# EAGLE design Board Playground4Robotics_V3 (EAGLE 9.5.2)
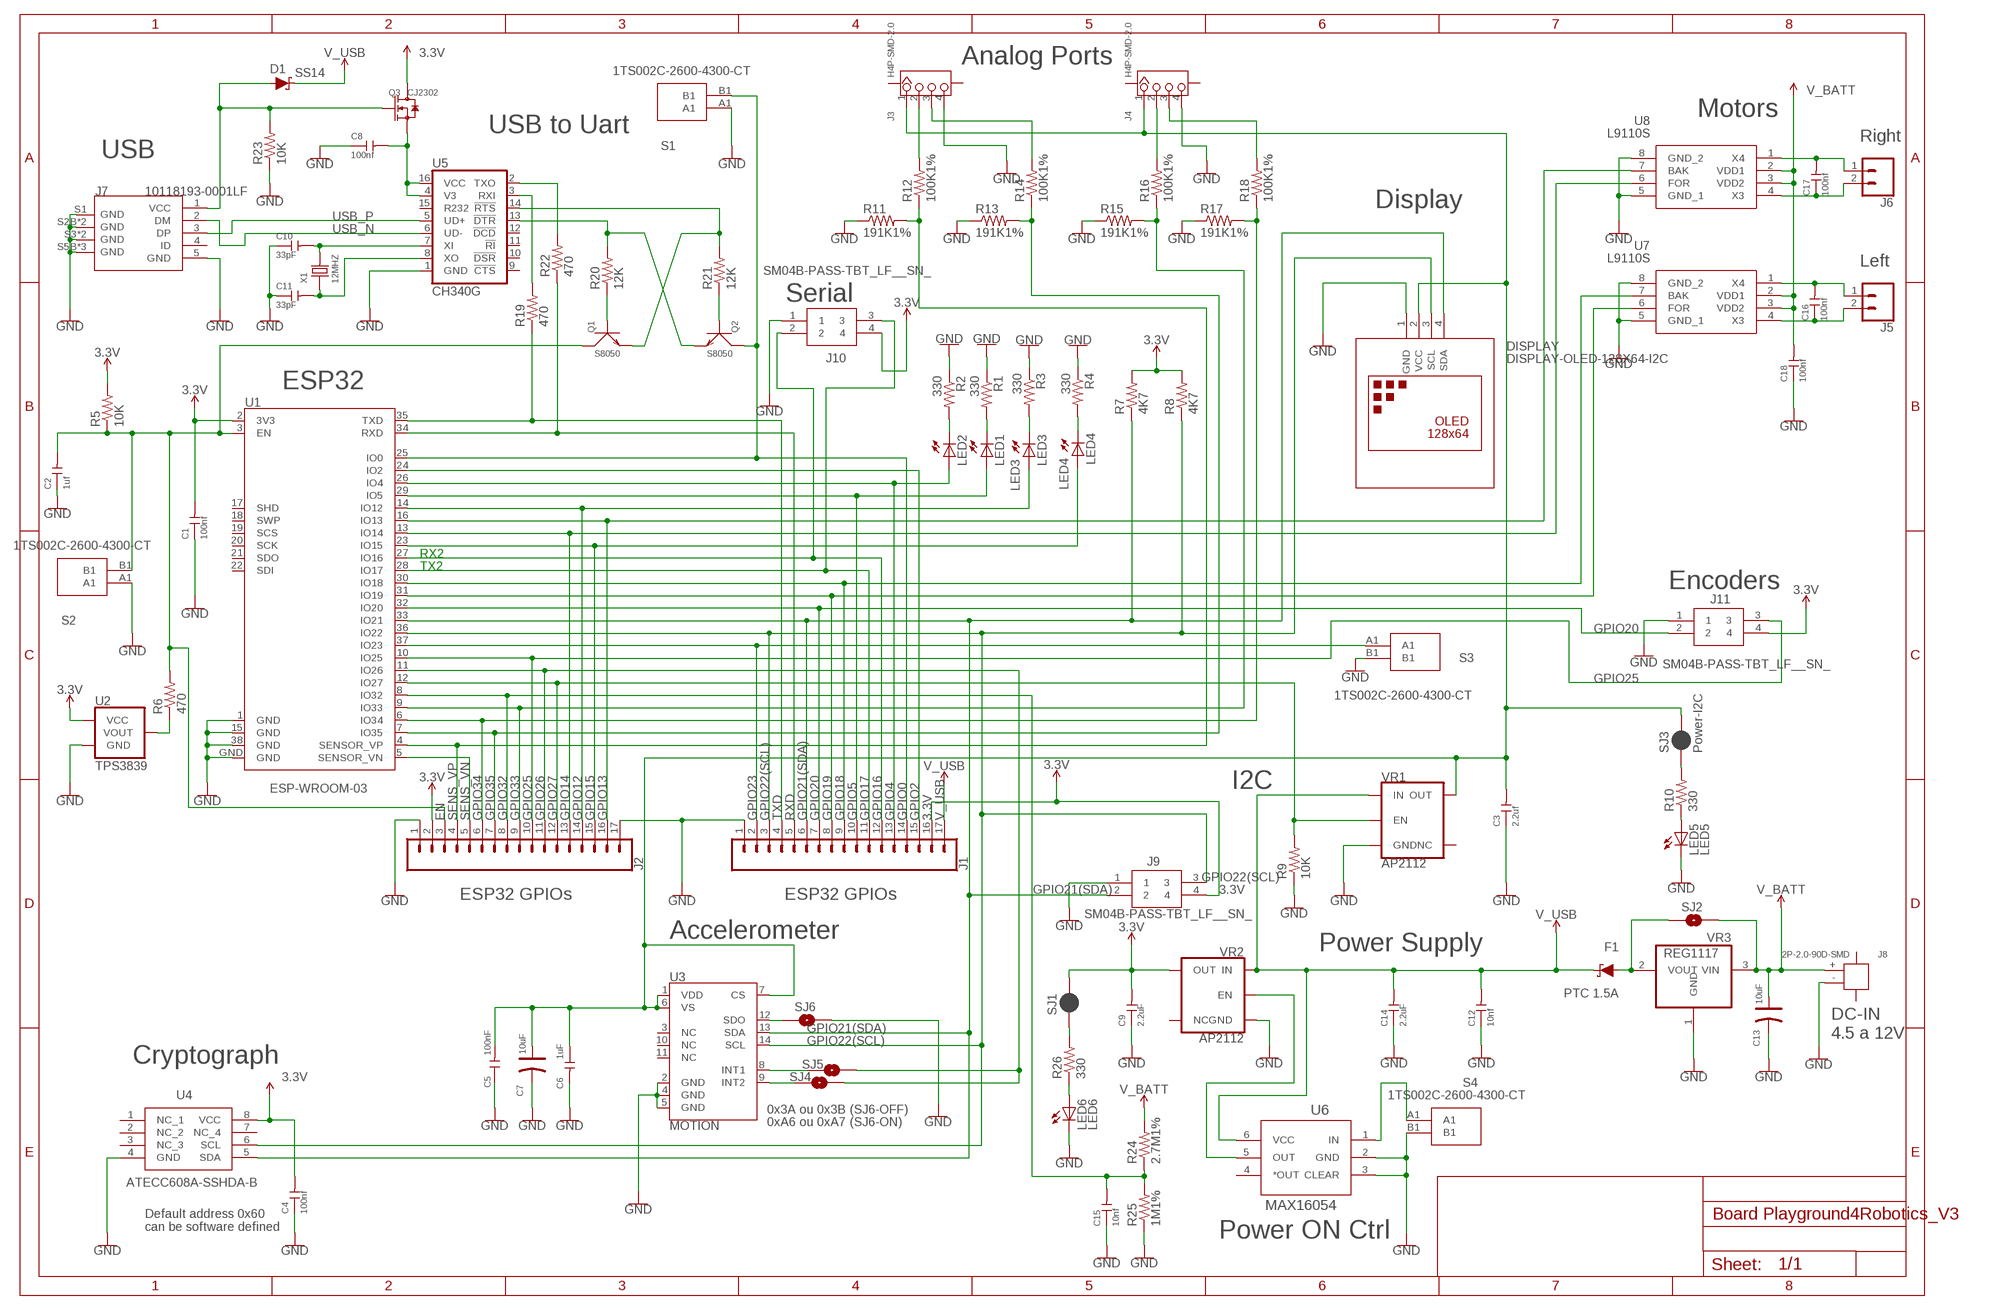
[diagram p0: schematic, sheet 1]

## Parts
C1  100nf  CERAMIC-100NF-50V-10%-X7R(0603)  [C0603]
C2  1uf  CERAMIC-100NF-50V-10%-X7R(0603)  [C0603]
C3  2.2uf  CERAMIC-2.2UF-10V-10%-X7R(0603)  [C0603]
C4  100nf  CERAMIC-100NF-50V-10%-X7R(0603)  [C0603]
C5  100nF  C-0603  [C0603]
C6  1uF  C-0805  [C0805]
C7  10uF  CAP-AVX-A  [AVX-A]
C8  100nf  CERAMIC-100NF-50V-10%-X7R(0603)  [C0603]
C9  2.2uF  CERAMIC-2.2UF-10V-10%-X7R(0603)  [C0603]
C10  33pF  CERAMIC-10PF-50V-5%-NPO(0603)  [C0603]
C11  33pF  CERAMIC-10PF-50V-5%-NPO(0603)  [C0603]
C12  10nf  CERAMIC-100NF-50V-10%-X7R(0603)  [C0603]
C13  10uF  CAP-AVX-A  [AVX-A]
C14  2.2uF  CERAMIC-2.2UF-10V-10%-X7R(0603)  [C0603]
C15  10nf  CERAMIC-100NF-50V-10%-X7R(0603)  [C0603]
C16  100nf  CERAMIC-100NF-50V-10%-X7R(0603)  [C0603]
C17  100nf  CERAMIC-100NF-50V-10%-X7R(0603)  [C0603]
C18  100nf  CERAMIC-100NF-50V-10%-X7R(0603)  [C0603]
D1  SS14  DIODE-SCHOTTKY-SS14  [SMA-DIODE]
DISPLAY  DISPLAY-OLED-128X64-I2C  [DISPLAY-OLED-128X64-I2C]
F1  PTC 1.5A  DIODE-SCHOTTKY-SS14  [SMA-DIODE]
J1  CONN_17  [1X17]
J2  CONN_17  [1X17]
J3  H4P-SMD-2.0  GROVE-CONNECTOR-SMD(4+2P-2.0)  [HW4-SMD-2.0]
J4  H4P-SMD-2.0  GROVE-CONNECTOR-SMD(4+2P-2.0)  [HW4-SMD-2.0]
J5  CONN_02POLAR  [MOLEX-1X2]
J6  CONN_02POLAR  [MOLEX-1X2]
J7  10118193-0001LF  MICRO-USB-SMD-B-(10118193-0001LF)  [MICRO-USB5+6P-SMD-0.65-B]
J8  2P-2.0-90D-SMD  CONN-HEADER-SMD-PH-SIDE-(2P-2.0MM)  [HW2-SMD-2.0-90D]
J9  SM04B-PASS-TBT_LF__SN_  [SM04B-PASS-TBT]
J10  SM04B-PASS-TBT_LF__SN_  [SM04B-PASS-TBT]
J11  SM04B-PASS-TBT_LF__SN_  [SM04B-PASS-TBT]
LED1  LED1  LED0603  [LED-0603]
LED2  LED2  LED0603  [LED-0603]
LED3  LED3  LED0603  [LED-0603]
LED4  LED4  LED0603  [LED-0603]
LED5  LED5  LED0603  [LED-0603]
LED6  LED6  LED0603  [LED-0603]
Q1  S8050  SMD-TRANSISTORS-NPN-25V-500MW-S8050(SOT-23)  [SOT-23]
Q2  S8050  SMD-TRANSISTORS-NPN-25V-500MW-S8050(SOT-23)  [SOT-23]
Q3  CJ2302  SMD-MOSFET-N-CH-20V-2.1A-CJ2302(SOT-23)  [SOT-23]
R1  330  RESISTOR0805-RES  [0805]
R2  330  RESISTOR0805-RES  [0805]
R3  330  RESISTOR0805-RES  [0805]
R4  330  RESISTOR0805-RES  [0805]
R5  10K  RESISTOR0805-RES  [0805]
R6  470  RESISTOR0805-RES  [0805]
R7  4K7  RESISTOR0805-RES  [0805]
R8  4K7  RESISTOR0805-RES  [0805]
R9  10K  RESISTOR0805-RES  [0805]
R10  330  RESISTOR0805-RES  [0805]
R11  191K1%  RESISTOR0805-RES  [0805]
R12  100K1%  RESISTOR0805-RES  [0805]
R13  191K1%  RESISTOR0805-RES  [0805]
R14  100K1%  RESISTOR0805-RES  [0805]
R15  191K1%  RESISTOR0805-RES  [0805]
R16  100K1%  RESISTOR0805-RES  [0805]
R17  191K1%  RESISTOR0805-RES  [0805]
R18  100K1%  RESISTOR0805-RES  [0805]
R19  470  RESISTOR0805-RES  [0805]
R20  12K  RESISTOR0805-RES  [0805]
R21  12K  RESISTOR0805-RES  [0805]
R22  470  RESISTOR0805-RES  [0805]
R23  10K  RESISTOR0805-RES  [0805]
R24  2.7M1%  RESISTOR0805-RES  [0805]
R25  1M1%  RESISTOR0805-RES  [0805]
R26  330  RESISTOR0805-RES  [0805]
S1  1TS002C-2600-4300-CT  [1TS002C26004300CT]
S2  1TS002C-2600-4300-CT  [1TS002C26004300CT]
S3  1TS002C-2600-4300-CT  [1TS002C26004300CT]
S4  1TS002C-2600-4300-CT  [1TS002C26004300CT]
SJ1  Power-Led  JUMPER-SMT_2_NC_PASTE_SILK  [SMT-JUMPER_2_NC_PASTE_SILK]
SJ2  ADXL_ADDRESS  SOLDERJUMPERNO  [SJ_2S-NO]
SJ3  Power-I2C  JUMPER-SMT_2_NC_PASTE_SILK  [SMT-JUMPER_2_NC_PASTE_SILK]
SJ4  INT1  SOLDERJUMPERNO  [SJ_2S-NO]
SJ5  INT1  SOLDERJUMPERNO  [SJ_2S-NO]
SJ6  ADXL_ADDRESS  SOLDERJUMPERNO  [SJ_2S-NO]
U1  ESP-WROOM-03  [ESP-WROOM-03]
U2  TPS3839  V_SUPERVISOR  [SOT23-3]
U3  MOTION  ADXL345  [LGA-14]
U4  ATECC608A-SSHDA-B  [SOIC127P600X175-8N]
U5  CH340G  CH340GSMD  [SO016]
U6  MAX16054  [SOT23-6]
U7  L9110S  [SOIC127P600X175-8N]
U8  L9110S  [SOIC127P600X175-8N]
VR1  AP2112  V_REG_AP2112K-3.3V  [SOT23-5]
VR2  AP2112  V_REG_AP2112K-3.3V  [SOT23-5]
VR3  REG1117  [SOT223]
X1  12MHZ  SMD-CRYSTAL-12MHZ-20PF-20PPM-40R(2P-5.0X3.2MM)  [X2-SMD-5.0X3.2X1.3MM]

## Nets
3.3V [power]: C1.2 C4.2 C9.2 J1.16 J2.2 J9.4 J10.4 J11.4 Q3.3(D) R5.2 R7.2 R8.2 SJ1.2 U1.2(3V3) U2.3(VCC) U4.8(VCC) VR2.5(OUT)
EN: C2.2 J2.3 Q1.3(C) R5.1 R6.2 S2.B1 U1.3(EN)
GND [power]: C1.1 C2.1 C3.1 C4.1 C5.1 C6.2 C7.- C8.1 C9.1 C10.1 C11.1 C12.1 C13.- C14.1 C15.1 C18.1 DISPLAY.1(GND) J1.1 J2.1 J2.17 J3.4 J4.4 J7.5(GND) J7.S1(GND) J7.S2B(GND) J7.S2T(GND) J7.S3(GND) J7.S4(GND) J7.S5B(GND) J7.S5T(GND) J7.S6(GND) J8.- J9.1 J10.1 J11.1 LED5.C LED6.C R1.1 R2.1 R3.1 R4.1 R9.1 R11.1 R13.1 R15.1 R17.1 R23.1 R25.1 S1.A1 S2.A1 S3.B1 S4.B1 SJ6.2 U1.1(GND) U1.15(GND) U1.38(GND) U1.GND U2.1(GND) U3.2(GND) U3.4(GND) U3.5(GND) U4.4(GND) U5.1(GND) U6.2(GND) U6.3(CLEAR) U7.5(GND_1) U7.8(GND_2) U8.5(GND_1) U8.8(GND_2) VR1.2(GND) VR2.2(GND) VR3.1(GND)
GPIO0: J1.14 Q2.3(C) S1.B1 U1.25(IO0)
GPIO2: J1.15 U1.24(IO2)
GPIO4: J1.13 LED2.A U1.26(IO4)
GPIO5: J1.10 LED1.A U1.29(IO5)
GPIO12: J2.14 LED3.A U1.14(IO12)
GPIO13: J2.16 U1.16(IO13) U8.7(BAK)
GPIO14: J2.13 U1.13(IO14) U8.6(FOR)
GPIO15: J2.15 LED4.A U1.23(IO15)
GPIO16: J1.12 J10.2 U1.27(IO16)
GPIO17: J1.11 J10.3 U1.28(IO17)
GPIO18: J1.9 U1.30(IO18) U7.7(BAK)
GPIO19: J1.8 U1.31(IO19) U7.6(FOR)
GPIO20: J1.7 J11.2 U1.32(IO20)
GPIO21(SDA): DISPLAY.4(SDA) J1.6 J9.2 R7.1 U1.33(IO21) U3.13(SDA) U4.5(SDA)
GPIO22(SCL): DISPLAY.3(SCL) J1.3 J9.3 R8.1 U1.36(IO22) U3.14(SCL) U4.6(SCL)
GPIO23: J1.2 S3.A1 U1.37(IO23)
GPIO25: J2.10 J11.3 U1.10(IO25)
GPIO26: J2.11 SJ4.2 SJ5.2 U1.11(IO26)
GPIO27: J2.12 R9.2 U1.12(IO27) VR1.3(EN)
GPIO32: C15.2 J2.8 R24.1 R25.2 U1.8(IO32)
GPIO33: J2.9 R15.2 R16.1 U1.9(IO33)
GPIO34: J2.6 R17.2 R18.1 U1.6(IO34)
GPIO35: J2.7 R13.2 R14.1 U1.7(IO35)
N$1: D1.A J7.1(VCC) Q3.1(G) R23.2
N$3 [VBAT]: C17.2 J6.1 U8.1(X4)
N$4: R6.1 U2.2(VOUT)
N$7: J3.2 R12.2
N$8: SJ5.1 U3.8(INT1)
N$9: SJ4.1 U3.9(INT2)
N$10 [power]: C8.2 Q3.2(S) U5.4(V3) U5.16(VCC)
N$14: S4.A1 U6.1(IN)
N$15: C10.2 U5.7(XI) X1.2
N$18 [power]: U6.5(OUT) VR2.3(EN)
N$19: Q1.1(B) R20.1
N$20: C11.2 U5.8(XO) X1.1
N$21: SJ6.1 U3.12(SDO)
N$22 [VBAT]: C17.1 J6.2 U8.4(X3)
N$23 [VBAT]: C16.2 J5.1 U7.1(X4)
N$24 [VBAT]: C16.1 J5.2 U7.4(X3)
N$25: J3.3 R14.2
N$30: Q2.1(B) R21.1
N$31 [power]: F1.A SJ2.1 VR3.2(VOUT)
N$32: LED2.C R2.2
N$33: LED1.C R1.2
N$34: Q1.2(E) R21.2 U5.14(!RTS)
N$35: LED4.C R4.2
N$36: LED3.C R3.2
N$38: Q2.2(E) R20.2 U5.13(!DTR)
N$41: J4.2 R16.2
N$42: J4.3 R18.2
N$43 [power]: C3.2 C5.2 C6.1 C7.+ DISPLAY.2(VCC) J3.1 J4.1 SJ3.2 U3.1(VDD) U3.6(VS) U3.7(CS) VR1.5(OUT)
N$44: R19.2 U5.3(RXI)
N$45: R22.2 U5.2(TXO)
N$51: LED6.A R26.1
N$52: R26.2 SJ1.1
N$55: LED5.A R10.1
N$58: R10.2 SJ3.1
RXD: J1.5 R22.1 U1.34(RXD)
SENS_VN: J2.5 U1.5(SENSOR_VN)
SENS_VP: J2.4 R11.2 R12.1 U1.4(SENSOR_VP)
TXD: J1.4 R19.1 U1.35(TXD)
USB_N [diff pairs]: J7.2(DM) U5.6(UD-)
USB_P [diff pairs]: J7.3(DP) U5.5(UD+)
V_BATT [VBAT]: C13.+ C18.2 J8.+ R24.2 SJ2.2 U7.2(VDD1) U7.3(VDD2) U8.2(VDD1) U8.3(VDD2) VR3.3(VIN)
V_USB [power]: C12.2 C14.2 D1.C F1.C J1.17 U6.6(VCC) VR1.1(IN) VR2.1(IN)
Unconnected: J3.SS1 J3.SS2 J4.SS1 J4.SS2 J7.4(ID) J8.3 J8.4 U1.17(SHD) U1.18(SWP) U1.19(SCS) U1.20(SCK) U1.21(SDO) U1.22(SDI) U3.3(NC) U3.10(NC) U3.11(NC) U4.1(NC_1) U4.2(NC_2) U4.3(NC_3) U4.7(NC_4) U5.9(!CTS) U5.10(!DSR) U5.11(!RI) U5.12(!DCD) U5.15(R232) U6.4(*OUT) VR1.4(NC) VR2.4(NC)

## Notes on the sheet
- Analog Ports
- Motors
- USB to Uart
- Right
- USB
- Display
- Left
- Serial
- ESP32
- RX2
- TX2
- Encoders
- I2C
- ESP32 GPIOs | ESP32 GPIOs
- Accelerometer
- Power Supply
- DC-IN
  4.5 a 12V
- Cryptograph
- 0x3A ou 0x3B (SJ6-OFF)
- 0xA6 ou 0xA7 (SJ6-ON)
- Default address 0x60
  can be software defined
- Power ON Ctrl

## Library data of the parts
C1 C4 C8 C16-C18 = OPL_Capacitor:CERAMIC-100NF-50V-10%-X7R(0603): 302010138; MPN: CC0603KRX7R9BB104
C2 C12 C15 = OPL_Capacitor:CERAMIC-100NF-50V-10%-X7R(0603): 302010138; MPN: CC0603KRX7R9BB104; VALUE: 100nf
C3 = OPL_Capacitor:CERAMIC-2.2UF-10V-10%-X7R(0603): 302010054; MPN: CC0603KRX7R6BB225
C5 C6 = Discrete:C*: Ceramic Capacitors
C7 C13 = Discrete:CAP*: Electrolytic Capacitors,Tantalum Capacitors and Super Capacitors
C9 C14 = OPL_Capacitor:CERAMIC-2.2UF-10V-10%-X7R(0603): 302010054; MPN: CC0603KRX7R6BB225; VALUE: 2.2uf
C10 C11 = OPL_Capacitor:CERAMIC-10PF-50V-5%-NPO(0603): 302010097; MPN: CC0603JRNPO9BN100; VALUE: 10pf
D1 F1 = SparkFun-DiscreteSemi:DIODE-SCHOTTKY: Schottky diode A Schottky diode is a semiconductor diode which has a low forward voltage drop and a very fast switching action.; PROD_ID: DIO-08053; VALUE: 1A/40V/500mV
DISPLAY = diy-modules:DISPLAY-OLED-128X64-I2C: 128x64 Dot Matrix OLED Module based on SSD1306 chip Variant with I2C interface More details available here: http://www.instructables.com/id/Monochrome-096-i2c-OLED-display-with-arduino-SSD13/ SSD1306 datasheet: https://cdn-shop.adafruit.com/datasheets/SSD1306.pdf Click here to find device on ebay.com <http://www.ebay.com/sch/oled+display+128x64+iic> Note: There are two variants: I2C and SPI. Search for the proper version.
J1 J2 = SparkFun-Connectors:CONN_17: Multi connection point. Often used as Generic Header-pin footprint for 0.1 inch spaced/style header connections On any of the 0.1 inch spaced packages, you can populate with these: Break Away Headers - Straight <https://www.sparkfun.com/products/116> (PRT-00116) Break Away Male Headers - Right Angle <https://www.sparkfun.com/products/553> (PRT-00553) Female Headers <https://www.sparkfun.com/products/115> (PRT-00115) Break Away Headers - Machine Pin <https://www.sparkfun.com/products/117> (PRT-00117) Break Away Female Headers - Swiss Machine Pin <https://www.sparkfun.com/products/743> (PRT-00743) For SCREWTERMINALS and SPRING TERMINALS visit here: Screw Terimnals on SparkFun.com <https://www.sparkfun.com/search/results?term=Screw+Terminals> (5mm/3.5mm/2.54mm spacing) This device is also useful as a general connection point to wire up your design to another part of your project. Our various solder wires solder well into these plated through hole pads. Hook-Up Wire - Assortment (Stranded, 22 AWG) <https://www.sparkfun.com/products/11375> (PRT-11375) Hook-Up Wire - Assortment (Solid Core, 22 AWG) <https://www.sparkfun.com/products/11367> (PRT-11367) View the entire wire category on our website here <https://www.sparkfun.com/categories/141> Special notes: Molex polarized connector foot print use with SKU : PRT-08231 with associated crimp pins and housings. 1MM SMD Version SKU: PRT-10208 NOTES ON THE VARIANTS LOCK and LOCK_LONGPADS... This footprint was designed to help hold the alignment of a through-hole component (i.e. 6-pin header) while soldering it into place. You may notice that each hole has been shifted either up or down by 0.005 of an inch from it's more standard position (which is a perfectly straight line). This slight alteration caused the pins (the squares in the middle) to touch the edges of the holes. Because they are alternating, it causes a "brace" to hold the component in place. 0.005 has proven to be the perfect amount of "off-center" position when using our standard breakaway headers. Although looks a little odd when you look at the bare footprint, once you have a header in there, the alteration is very hard to notice. Also,if you push a header all the way into place, it is covered up entirely on the bottom side.
J3 = OPL_Connector:GROVE-CONNECTOR-SMD(4+2P-2.0): 320110030; SPICEPREFIX: X
J4 = OPL_Connector:GROVE-CONNECTOR-SMD(4+2P-2.0): 320110030
J5 J6 = SparkFun-Connectors:CONN_02: Multi connection point. Often used as Generic Header-pin footprint for 0.1 inch spaced/style header connections On any of the 0.1 inch spaced packages, you can populate with these: Break Away Headers - Straight <https://www.sparkfun.com/products/116> (PRT-00116) Break Away Male Headers - Right Angle <https://www.sparkfun.com/products/553> (PRT-00553) Female Headers <https://www.sparkfun.com/products/115> (PRT-00115) Break Away Headers - Machine Pin <https://www.sparkfun.com/products/117> (PRT-00117) Break Away Female Headers - Swiss Machine Pin <https://www.sparkfun.com/products/743> (PRT-00743) For SCREWTERMINALS and SPRING TERMINALS visit here: Screw Terimnals on SparkFun.com <https://www.sparkfun.com/search/results?term=Screw+Terminals> (5mm/3.5mm/2.54mm spacing) This device is also useful as a general connection point to wire up your design to another part of your project. Our various solder wires solder well into these plated through hole pads. Hook-Up Wire - Assortment (Stranded, 22 AWG) <https://www.sparkfun.com/products/11375> (PRT-11375) Hook-Up Wire - Assortment (Solid Core, 22 AWG) <https://www.sparkfun.com/products/11367> (PRT-11367) View the entire wire category on our website here <https://www.sparkfun.com/categories/141> Special notes: Molex polarized connector foot print use with: PRT-08233 with associated crimp pins and housings. 2.54_SCREWTERM for use with PRT-10571. 3.5mm Screw Terminal footprints for PRT-08084 5mm Screw Terminal footprints for use with PRT-08432; SF_ID: PRT-09918
J7 = OPL_Connector:MICRO-USB-SMD-B-(10118193-0001LF): Seeed SKU 320010003 - SMD Micro USB-B MPN: 10118193-0001LF Important Notes: This part requires milling slots. Please make sure layer 46 Milling is included in the profile or outline layer when exporting Gerber files. Alternatively, you can use the built-in Seeed Fusion CAM file. Find it under Third-Party CAM files. This part has an overhanging portion. The edge of the PCB should be aligned with the line marked PCB Edge to be mounted correctly. Seeed Fusion PCBA OPL <https://www.seeedstudio.com/opl.html> Order PCB/PCBA Now <https://www.seeedstudio.com/fusion_pcb.html> www.seeedstudio.com; MPN: 10118193-0001LF
J8 = OPL_Connector:CONN-HEADER-SMD-PH-SIDE-(2P-2.0MM): 320110026
J9-J11 = SM04B-PASS-TBT_LF__SN_:SM04B-PASS-TBT_LF__SN_: JST (JAPAN SOLDERLESS TERMINALS) - SM04B-PASS-TBT(LF)(SN) - CONNECTOR, HEADER, 4POS, 1ROW, 2MM Source: Datasheet <http://www.jst-mfg.com/product/pdf/eng/ePA-F.pdf>; DESCRIPTION: JST (JAPAN SOLDERLESS TERMINALS) - SM04B-PASS-TBT(LF)(SN) - CONNECTOR, HEADER, 4POS, 1ROW, 2MM; HEIGHT: mm; MANUFACTURER_NAME: JST (JAPAN SOLDERLESS TERMINALS); MANUFACTURER_PART_NUMBER: SM04B-PASS-TBT(LF)(SN)
LED1-LED6 = FTDI Basic-v22-3.3V:LED: LEDs Standard schematic elements and footprints for 5mm, 3mm, 1206, and 0603 sized LEDs. 5mm - Spark Fun Electronics SKU : COM-00529 (and others)
Q1 Q2 = OPL_Discrete_Semiconductor:SMD-TRANSISTORS-NPN-25V-500MW-S8050(SOT-23): 305010017; MPN: S8050
Q3 = OPL_Discrete_Semiconductor:SMD-MOSFET-N-CH-20V-2.1A-CJ2302(SOT-23): 305030015; MPN: CJ2302
R1-R11 R13-R15 R17-R26 = FTDI Basic-v22-3.3V:RESISTOR: Resistor Basic schematic elements and footprints for 0603, 1206, and PTH resistors.
R12 R16 = FTDI Basic-v22-3.3V:RESISTOR: Resistor Basic schematic elements and footprints for 0603, 1206, and PTH resistors.; SPICEPREFIX: R
S1-S4 = 1TS002C-2600-4300-CT:1TS002C-2600-4300-CT: Tactile Switches SPST 6.00mm x 3.50mm 0.80mm 50mA @ 12VDC SMD,6x3.5x4.3mm RoHS Source: Datasheet <https://datasheet.lcsc.com/szlcsc/HYP-1TS002C-2600-4300_C319342.pdf>; DESCRIPTION: Tactile Switches SPST 6.00mm x 3.50mm 0.80mm 50mA @ 12VDC SMD,6x3.5x4.3mm RoHS; HEIGHT: 4.5mm; MANUFACTURER_NAME: HYP (Hongyuan Precision); MANUFACTURER_PART_NUMBER: 1TS002C-2600-4300-CT
SJ1 SJ3 = SparkFun-Jumpers:JUMPER-SMT_2_NC_PASTE: Normally closed solder jumper This jumper has an aperture in the stencil to allow solder paste to bridge the split in the wire so it's normally closed (NC). Wick off the solder to open the connection. Reapply solder to reclose the connection.
SJ2 SJ4-SJ6 = JL-temp:SOLDERJUMPER: Solder Jumper Standard SMD solder jumper. Used to automate production. Two varients : Normally Open and Normally Closed are the same, but have different paste layers. NC will have a large amount of paste and should jumper during reflow.
U1 = esp32:ESP-WROOM-03
U2 = SparkFun-IC-Power:V_SUPERVISOR: BD48xxx - Voltage Detector IC ROHM’s BD48xxx and BD49xxx series are highly accurate, low-current Voltage Detector IC series. The family includes BD48xxx devices with N-channel open drain output and BD49xxx devices with CMOS output. The devices are available for specific detection voltages ranging from 2.3V to 6.0V in increments of 0.1V.; PROD_ID: IC-14809
U3 = SparkFun-Sensors:ADXL345: Analog Devices ADXL345 3-Axis SPI/I2C 2/4/8/16g Accelerometer The ADXL345 is a small, thin, low power, 3-axis accelerometer with high resolution (13-bit) measurement at up to ±16g. Digital output data is formatted as 16-bit twos complement and is accessible through either a SPI (3- or 4-wire) or I2C digital interface. Datasheet <https://www.sparkfun.com/datasheets/Sensors/Accelerometer/ADXL345.pdf> SparkFun Products SparkFun Triple Axis Accelerometer Breakout - ADXL345 <https://www.sparkfun.com/products/9836> (SEN-09836) Triple Axis Accelerometer - ADXL345 <https://www.sparkfun.com/products/9045> (SEN-09045) SparkFun 6 Degrees of Freedom IMU Digital Combo Board - ITG3200/ADXL345 <https://www.sparkfun.com/products/10121> (SEN-10121); PROD_ID: IC-09097; SF_ID: SEN-09045
U4 = ATECC608A-SSHDA-B:ATECC608A-SSHDA-B: Cryptoathentication ECC608A SOIC Source: Datasheet <http://ww1.microchip.com/downloads/en/DeviceDoc/40001977A.pdf>; ARROW_PART_NUMBER: ATECC608A-SSHDA-B; ARROW_PRICE-STOCK: https://www.arrow.com/en/products/atecc608a-sshda-b/microchip-technology; DESCRIPTION: Cryptoathentication ECC608A SOIC; HEIGHT: 1.75mm; MANUFACTURER_NAME: Microchip; MANUFACTURER_PART_NUMBER: ATECC608A-SSHDA-B; MOUSER_PART_NUMBER: 556-ATECC608ASSHDAB; MOUSER_PRICE-STOCK: https://www.mouser.co.uk/ProductDetail/Microchip-Technology-Atmel/ATECC608A-SSHDA-B?qs=wd5RIQLrsJj8ay8%2FHpTWlw%3D%3D
U5 = SparkFun-IC-Comms:CH340G: A simple USB 2.0 to Serial IC.; PROD_ID: IC-13498
U6 = max16054:MAX16054: MAXIM Integrated power controller chip; MF: Maxim Integrated; MOUSER: 700-MAX16054AZTT; MPN: MAX16054AZT+T
U7 U8 = L9110S:L9110S: Motor Drivers SOP-8_150mil RoHS Source: Datasheet <https://datasheet.lcsc.com/szlcsc/Wuxi-Zhongwei-Aisin-Elec-L9110S_C85174.pdf>; DESCRIPTION: Motor Drivers SOP-8_150mil RoHS; HEIGHT: 1.75mm; MANUFACTURER_NAME: Wuxi I-core Elec; MANUFACTURER_PART_NUMBER: L9110S
VR1 VR2 = SparkFun-IC-Power:V_REG_AP2112: AP2112 - 600mA CMOS LDO Regulator w/ Enable The AP2112 is CMOS process low dropout linear regulator with enable function, the regulator delivers a guaranteed 600mA (min.) continuous load current. Features Output Voltage Accuracy: ±1.5% Output Current: 600mA (Min.) Foldback Short Current Protection: 50mA Enable Function to Turn ON/OFF VOUT Low Dropout Voltage (3.3V): 250mV (Typ.) @IOUT=600mA Excellent Load Regulation: 0.2%/A (Typ.) Excellent Line Regulation: 0.02%/V (Typ.) Low Quiescent Current: 55μA (Typ.) Low Standby Current: 0.01μA (Typ.) Low Output Noise: 50μVRMS PSRR: 100Hz -65dB, 1kHz -65dB OTSD Protection Stable with 1.0μF Flexible Cap: Ceramic, Tantalum and Aluminum Electrolytic Operation Temperature Range: -40°C to 85°C ESD: MM 400V, HBM 4000V; PROD_ID: VREG-12457; VALUE: 3.3V
VR3 = burr-brown:REG1117: 800mA and 1A Low Dropout (LDO) Positive Regulator 1.8V, 2.5V, 2.85V, 3.3V, 5V, and Adj; MPN: REG1117; OC_FARNELL: 1097566; OC_NEWARK: 14P6981
X1 = OPL_Crystal Oscillator:SMD-CRYSTAL-12MHZ-20PF-20PPM-40R(2P-5.0X3.2MM): 306010047; MPN: 5032/2P

## Net classes
0 default: width 0.254 mm, clearance 0.127 mm
1 power: width 0.508 mm, clearance 0.127 mm
2 sensor: width 0.381 mm, clearance 0.127 mm
3 diff pairs: width 0.254 mm
4 VBAT: width 0.635 mm

## Board
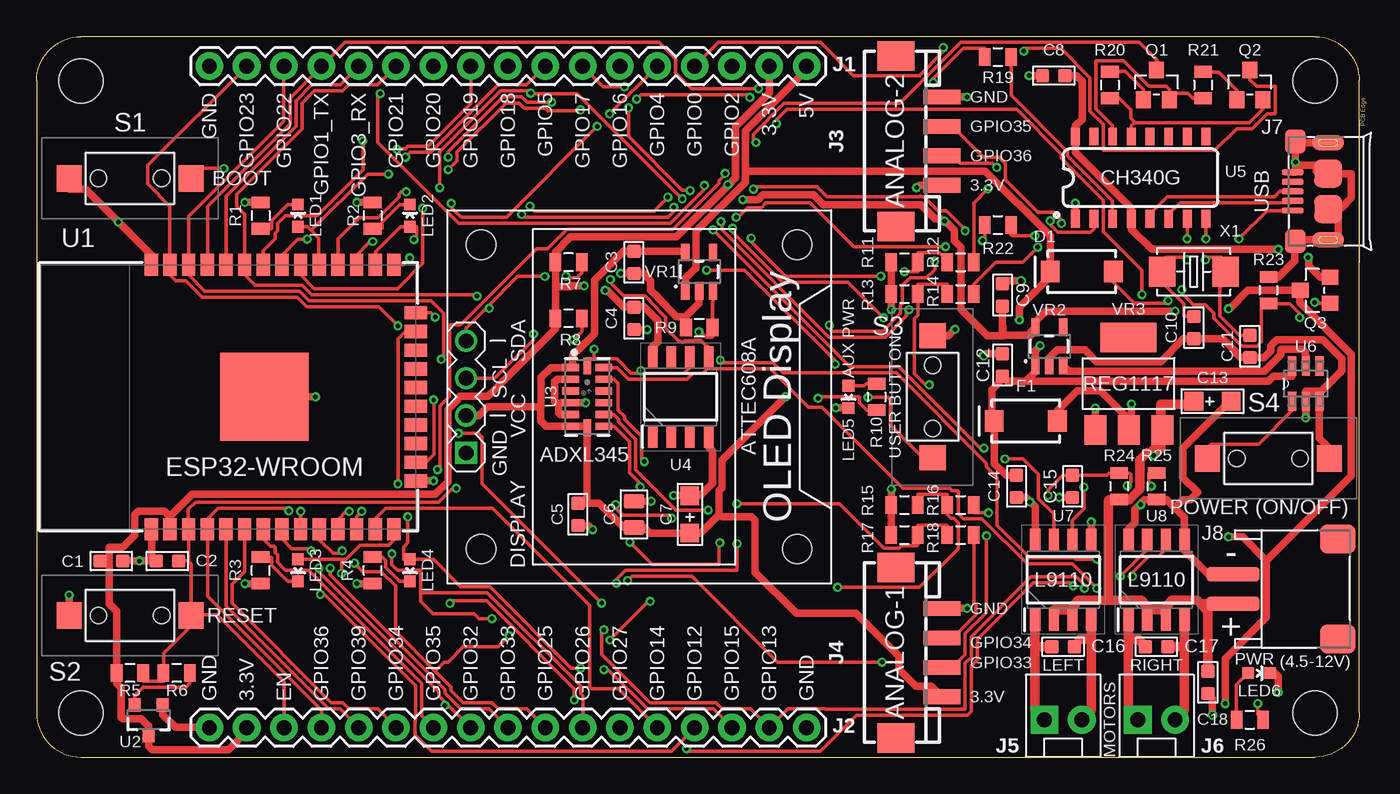
[diagram p1: board, top side]
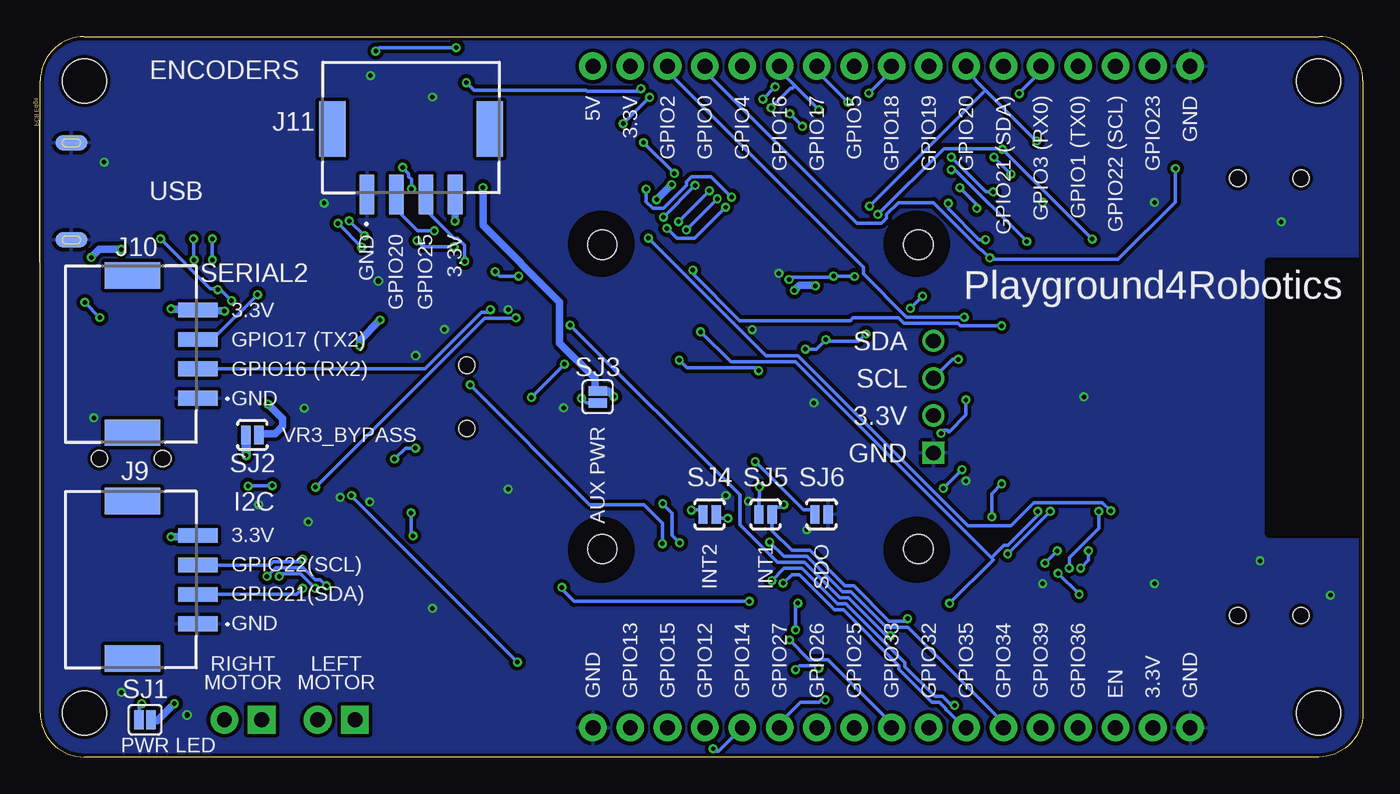
[diagram p2: board, bottom side, seen from below]

Size 90.03 x 49 mm. Coordinates in mm from the lower left corner, seen from the top.
Outline: 3,0 87,0 arc90 90,3 90,46 arc90 87,49 3,49 arc90 0,46 0,3 arc90 3,0
Copper layers (1*16): Top 0.035mm / dielectric 1.5mm / Bottom 0.035mm
Design rules "SeeedStudio_2layer_DRU_no_angle_20140221": minimum track width 6mil, minimum drill 12mil, track to track 6mil, track to pad 6mil, pad to pad 6mil, via to via 6mil, smd to smd 0mil, copper to edge 10mil, drill to drill 10mil, minimum pad ring 10mil, minimum via ring 6mil, stop-mask expansion 2mil, vias tented up to drill 100mil, thermal gap 10mil
Holes 3 mm at 3,3 3,46 87,46 87,3
tRestrict: area 0,15.2 to 6.3,33.7; area 1.5,1.5 to 4.5,4.5; area 1.5,44.5 to 4.5,47.5; area 85.5,44.5 to 88.5,47.5; area 85.5,1.5 to 88.5,4.5
bRestrict: area 0,15.2 to 6.3,33.7; area 29.4,33.9 to 31.4,35.9; area 50.8,33.9 to 52.8,35.9; area 29.4,13.1 to 31.4,15.1; area 50.8,13.1 to 52.8,15.1

### Footprints (pad centres in the part's own frame; a part is rotated, then mirrored left to right if it is on the bottom)
C0603 = smd 0.889 x 0.889: 1 0,0.762; 2 0,-0.762
C0603' = smd 0.889 x 0.889: 1 -0.762,0; 2 0.762,0
C0805 = smd 1.016 x 1.397: 1 -0.889,0; 2 0.889,0
AVX-A = smd 1.27 x 1.27: + -1.27,0; - 1.27,0
SMA-DIODE = smd 1.27 x 1.47: A -2.15,0; C 2.15,0
DISPLAY-OLED-128X64-I2C = drill 1 square: 1 -3.81,11.78 | drill 1: 2 -1.27,11.78; 3 1.27,11.78; 4 3.81,11.78 | hole 2: -10.35,10.75; 10.35,10.75; 10.35,-10.75; -10.35,-10.75
1X17 = drill 1.016 pad 1.88: 1 0,0; 2 2.54,0; 3 5.08,0; 4 7.62,0; 5 10.16,0; 6 12.7,0; 7 15.24,0; 8 17.78,0; 9 20.32,0; 10 22.86,0; 11 25.4,0; 12 27.94,0; 13 30.48,0; 14 33.02,0; 15 35.56,0; 16 38.1,0; 17 40.64,0
HW4-SMD-2.0 = smd 1 x 2.5: 1 -3,0; 2 -1,0; 3 1,0; 4 3,0 | smd 2 x 2.5: SS1 -5.8,3.123; SS2 5.8,3.123
MOLEX-1X2 = drill 1.016 pad 1.88 square: 1 0,0 | drill 1.016 pad 1.88: 2 2.54,0
MICRO-USB5+6P-SMD-0.65-B = smd 0.4 x 1.5: 1 -1.3,-0.25; 2 -0.65,-0.25; 3 0,-0.25; 4 0.65,-0.25; 5 1.3,-0.25 | smd 1.6 x 1.4: S1 -3.4,-0.427; S6 3.4,-0.427 | smd 1.067 x 2.184 bottom: S2B -3.302,-2.667; S5B 3.302,-2.667 | smd 1.067 x 2.184: S2T -3.302,-2.667; S5T 3.302,-2.667 | smd 1.9 x 1.9: S3 -1.2,-2.675; S4 1.2,-2.675
HW2-SMD-2.0-90D = smd 2 x 2.4: 3 3.4,-2.181; 4 -3.4,-2.181 | smd 1 x 3.6: + -1,4.953; - 1,4.953
SM04B-PASS-TBT = smd 1 x 2.7: 1 -3,-0.1; 2 -1,-0.1; 3 1,-0.1; 4 3,-0.1 | smd 1.8 x 3.8: 5 -5.35,4.35; 6 5.35,4.35
LED-0603 = smd 0.8 x 0.8: A 0,-0.75; C 0,0.75
SOT-23 = smd 1.016 x 1.143: 1 -0.889,-1.016; 2 0.889,-1.016; 3 0,1.016
0805 = smd 0.8 x 1.2: 1 -0.9,0; 2 0.9,0
1TS002C26004300CT = smd 1.7 x 1.8: A1 -4.15,0; B1 4.15,0 | hole 1.1: -2.15,0; 2.15,0
SMT-JUMPER_2_NC_PASTE_SILK = smd 0.635 x 1.27: 1 -0.406,0; 2 0.406,0
SJ_2S-NO = smd 0.635 x 1.27: 1 -0.45,0; 2 0.45,0
ESP-WROOM-03 = smd 0.9 x 1.5: 1 7.7,9; 2 6.43,9; 3 5.16,9; 4 3.89,9; 5 2.62,9; 6 1.35,9; 7 0.08,9; 8 -1.19,9; 9 -2.46,9; 10 -3.73,9; 11 -5,9; 12 -6.27,9; 13 -7.54,9; 14 -8.81,9; 25 -8.81,-9; 26 -7.54,-9; 27 -6.27,-9; 28 -5,-9; 29 -3.73,-9; 30 -2.46,-9; 31 -1.19,-9; 32 0.08,-9; 33 1.35,-9; 34 2.62,-9; 35 3.89,-9; 36 5.16,-9; 37 6.43,-9; 38 7.7,-9 | smd 1.5 x 0.9: 15 -10.3,5.715; 16 -10.3,4.445; 17 -10.3,3.175; 18 -10.3,1.905; 19 -10.3,0.635; 20 -10.3,-0.635; 21 -10.3,-1.905; 22 -10.3,-3.175; 23 -10.3,-4.445; 24 -10.3,-5.715 | smd 6 x 6: GND 0,0
SOT23-3 = smd 0.8 x 0.9: 1 -0.95,-1; 2 0.95,-1; 3 0,1.1
LGA-14 = smd 0.5 x 1.124: 1 2,1.138; 2 1.2,1.138; 3 0.4,1.138; 4 -0.4,1.138; 5 -1.2,1.138; 6 -2,1.138; 8 -2,-1.13; 9 -1.2,-1.138; 10 -0.4,-1.138; 11 0.4,-1.138; 12 1.2,-1.138; 13 2,-1.138 | smd 1.124 x 0.5: 7 -2.1,0; 14 2.1,0
SOIC127P600X175-8N = smd 1.5 x 0.65: 1 -2.7,1.905; 2 -2.7,0.635; 3 -2.7,-0.635; 4 -2.7,-1.905; 5 2.7,-1.905; 6 2.7,-0.635; 7 2.7,0.635; 8 2.7,1.905
SO016 = smd 0.6 x 1.2: 1 -4.445,-2.8; 2 -3.175,-2.8; 3 -1.905,-2.8; 4 -0.635,-2.8; 5 0.635,-2.8; 6 1.905,-2.8; 7 3.175,-2.8; 8 4.445,-2.8; 9 4.445,2.8; 10 3.175,2.8; 11 1.905,2.8; 12 0.635,2.8; 13 -0.635,2.8; 14 -1.905,2.8; 15 -3.175,2.8; 16 -4.445,2.8
SOT23-6 = smd 1.321 x 0.559: 1 -1.194,0.94; 2 -1.194,0; 3 -1.194,-0.94; 4 1.194,-0.94; 5 1.194,0; 6 1.194,0.94
SOIC127P600X175-8N' = smd 1.525 x 0.7: 1 -2.712,1.905; 2 -2.712,0.635; 3 -2.712,-0.635; 4 -2.712,-1.905; 5 2.712,-1.905; 6 2.712,-0.635; 7 2.712,0.635; 8 2.712,1.905
SOT23-5 = smd 0.55 x 1.2: 1 -0.95,-1.3; 2 0,-1.3; 3 0.95,-1.3; 4 0.95,1.3; 5 -0.95,1.3
SOT223 = smd 1.499 x 2.007: 1 -2.261,-3.15; 2 0.025,-3.15; 3 2.311,-3.15 | smd 3.81 x 2.007: 4 0,3.15
X2-SMD-5.0X3.2X1.3MM = smd 1.778 x 2.032: 1 -2.159,0; 2 2.159,0

### Placement (x,y rotation side)
C1  5.08,13.34 270 top
C2  8.89,13.34 90 top
C3  40.64,33.66 180 top
C4  40.64,29.84 180 top
C5  100nF  [C0603']  36.83,16.51 90 top
C6  40.64,16.51 90 top
C7  44.45,16.51 90 top
C8  69.22,46.35 90 top
C9  65.72,31.43 0 top
C10  78.74,29.21 180 top
C11  82.55,27.94 180 top
C12  65.72,26.67 0 top
C13  80.01,24.2 0 top
C14  66.67,18.41 180 top
C15  70.48,18.41 180 top
C16  69.85,7.5 270 top
C17  76.2,7.5 270 top
C18  79.69,5.08 180 top
D1  71.12,33.02 180 top
DISPLAY  41,24.5 90 top
F1  67.31,22.86 180 top
J1  11.75,47 0 top
J2  11.75,2 0 top
J3  61.59,41.9 90 top
J4  61.59,7.1 90 top
J5  68.58,2.54 0 top
J6  74.93,2.54 0 top
J7  85.22,38.48 90 top
J8  86.36,11.43 90 top
J9  79.38,12.06 90 bottom
J10  79.38,27.41 90 bottom
J11  64.77,38.38 0 bottom
LED1  17.78,36.83 0 top
LED2  25.4,36.83 0 top
LED3  17.78,12.7 180 top
LED4  25.4,12.7 180 top
LED5  55.24,24.5 180 top
LED6  83.19,5.71 270 top
Q1  76.2,45.72 0 top
Q2  82.55,45.72 0 top
Q3  87,31.75 90 top
R1  15.24,36.83 270 top
R2  22.86,36.83 270 top
R3  15.24,12.7 90 top
R4  22.86,12.7 90 top
R5  6.35,5.71 180 top
R6  9.53,5.71 180 top
R7  36.2,33.66 180 top
R8  36.2,29.84 180 top
R9  45.09,29.21 0 top
R10  57.15,24.5 270 top
R11  59.05,33.66 0 top
R12  62.87,33.66 0 top
R13  59.05,31.5 0 top
R14  62.87,31.5 0 top
R15  59.05,17.14 0 top
R16  62.87,17.14 0 top
R17  59.05,15.1 0 top
R18  62.87,15.1 0 top
R19  65.41,47.62 0 top
R20  73.03,45.72 270 top
R21  79.38,45.72 270 top
R22  65.41,36.2 0 top
R23  83.82,31.75 270 top
R24  73.66,18.41 270 top
R25  76.2,18.41 90 top
R26  82.55,2.54 0 top
S1  6.35,39.37 0 top
S2  6.35,9.63 0 top
S3  60.96,24.5 90 top
S4  83.82,20.32 0 top
SJ1  82.87,2.54 0 bottom
SJ2  75.56,21.91 180 bottom
SJ3  52.07,24.5 90 bottom
SJ4  44.45,16.51 0 bottom
SJ5  40.64,16.51 0 bottom
SJ6  36.83,16.51 0 bottom
U1  15.5,24.5 180 top
U2  7.62,2.54 180 top
U3  37.47,24.5 90 top
U4  43.81,24.5 90 top
U5  75.12,39.42 0 top
U6  86.36,25.4 90 top
U7  L9110S  [SOIC127P600X175-8N']  69.85,12.06 90 top
U8  L9110S  [SOIC127P600X175-8N']  76.2,12.06 90 top
VR1  45.09,33.02 0 top
VR2  68.9,27.94 0 top
VR3  74.3,25.4 0 top
X1  78.74,33.02 180 top

### Tracks (layer width: path | path; a pad name or v marks a point on that pad's centre or on a via)
3.3V  (via drill 0.3)
  Top 0.508: v80.87,3.63 80.87,6.68 83.69,9.5 83.69,13.36 | 83.69,13.36 82.07,14.98 v81.1,14.98 | v81.1,30.49 81.18,30.49 82.43,31.74 85.97,31.74 Q3.3 85.94,31.49 85.94,30.93 89.47,27.39 89.47,19.15 83.69,13.36 | v77.47,30.34 68.66,30.34 67.94,29.62 67.94,29.55 67.95,29.55 VR2.5 67.64,28.93 67.64,28.7 65.72,28.7 C9.2 65.72,29.66 65.77,28.67 64.69,28.67 62.9,30.46 62.9,34.69 62.46,35.12 62.46,35.84 61.85,36.45 v61.77,36.45 61.54,36.58 61.49,36.63 61.11,36.63 60.16,37.58 53.53,37.58 52.86,38.25 49.41,38.25 49.08,37.91 v48.05,37.91 | 4.89,13.34 C1.2 | 4.89,13.34 4.92,13.31 4.92,10.42 5.43,9.91 5.43,6.45 5.45,6.43 5.45,5.73 R5.2 5.45,5.48 5.45,5.02 5.76,4.71 5.76,2.69 5.84,2.61 7.12,2.61 7.63,2.1 7.63,1.46 U2.3 7.63,1.18 7.63,0.74 7.86,0.51 13.06,0.51 14.29,1.74 J2.2 | 9.06,16.36 9.06,15.51 U1.2 | 9.06,16.36 8.7,16.72 6.91,16.72 6.68,16.49 6.68,15.1 5.84,14.26 4.94,14.26 4.92,14.23 4.92,13.57 4.89,13.34 | U4.8 41.91,27.21 41.91,27.9 42.27,28.26 42.27,29.7 41.34,30.62 40.65,30.62 C4.2 40.4,30.62 39.94,30.62 38.81,31.74 v38.68,31.74 | 35.3,32 35.3,33.64 R7.2 35.3,33.92 35.3,34.35 36.33,35.38 43.55,35.38 47.07,38.9 | 35.3,32 R8.2 35.3,29.59 35.3,29.13 30.72,24.55 28.77,24.55 28.65,24.42 28.65,24.32 27.98,23.65 27.98,18.74 27.11,17.87 10.57,17.87 9.06,16.36 | 47.07,38.9 47.56,39.4 47.56,42.88 49.87,45.18 49.87,46.98 J1.16 | v37.25,32.05 36.38,32.05 36.33,32 35.3,32 | v47.03,38.94 47.07,38.9
  Bottom 0.508: v81.1,14.98 81.08,15 80.03,15 79.97,15.05 J9.4 | SJ1.2 82.03,2.47 v80.87,3.63 | v81.1,30.49 81.08,30.46 80.03,30.46 79.97,30.41 J10.4 79.03,30.41 78.57,30.41 78.52,30.36 77.49,30.36 v77.47,30.34 | v61.77,36.45 J11.4 | v38.68,31.74 38.32,32.1 37.3,32.1 v37.25,32.05 | v47.03,38.94 v48.05,37.91
EN  (via drill 0.3)
  Top 0.254: R5.1 7.25,5.17 8.63,5.17 R6.2 8.63,5.84 8.63,7.07 10.5,8.93 S2.B1 | J2.3 16.84,2.02 16.84,5.12 12.29,9.68 10.62,9.68 S2.B1 | 10.32,13.34 9.68,13.34 C2.2 | 10.32,13.34 10.34,13.36 10.34,15.49 U1.3 10.34,15.62 10.34,16.2 10.32,16.23 10.32,16.84 10.8,17.33 27.34,17.33 28.29,18.28 v28.54,18.28 | v48.95,41.8 48.77,41.98 48.77,42.37 50.87,44.47 58.75,44.47 62.9,48.61 75.03,48.61 76.21,47.44 Q1.3 | v46.85,39.71 46.85,39.6 46.44,39.19 46.44,39.04 43.31,35.92 36.1,35.92 34.77,34.59 34.02,34.59 28.85,29.41 28.13,29.41 28.11,29.39 28.11,24.55 27.44,23.89 27.44,19.74 v27.26,19.56 | S2.B1 10.5,9.75 10.5,13.13 10.39,13.23 10.32,13.34
  Bottom 0.254: v46.85,39.71 v48.95,41.8 | v28.54,18.28 v27.26,19.56
GND  (via drill 0.3, 0.35)
  Top 0.508: 87.3,24.86 87.27,24.88 86.37,24.88 86.35,24.86 U6.2 86.35,23.96 v86.35,23.07 | 87.3,24.86 U6.3 87.3,23.96 87.3,21.68 87.96,21.02 S4.B1 | VR2.2 68.91,27.15 69.45,27.7 71.32,27.7 72.11,26.91 76.49,26.91 78.03,28.44 78.49,28.44 C10.1 79.44,28.44 79.46,28.47 80.72,28.47 81.61,27.57 81.61,27.47 81.89,27.19 82.53,27.19 C11.1 82.79,27.19 83.25,27.19 83.28,27.16 83.51,27.16 83.99,27.65 83.99,27.98 84.4,28.39 87.53,28.39 88.81,27.11 88.81,26.27 87.53,24.99 87.3,24.86 | 75.1,17.22 74.73,16.84 74.73,15.92 74.29,15.49 74.29,14.8 U8.8 | 75.1,17.22 75.39,17.51 76.19,17.51 R25.1 76.47,17.51 76.9,17.51 77.46,16.96 | 77.46,16.96 78.11,16.31 78.11,14.8 U8.5 78.11,14.54 78.11,14.08 79.74,12.44 81.38,12.44 J8.- | 85.66,40.24 v85.66,40.47 85.66,41.14 85.63,41.16 85.63,41.86 J7.S6 85.86,41.78 87.86,41.78 J7.S5T | 85.66,40.24 85.66,39.78 J7.5 | 85.66,40.24 86.94,40.24 87.09,40.09 87.09,39.83 87.25,39.68 J7.S4 88.14,39.68 89.45,39.68 89.47,39.65 89.47,38.04 88.81,37.38 J7.S3 87.91,37.27 88.55,37.27 88.58,37.25 88.58,35.2 88.55,35.17 J7.S2T 87.63,35.17 85.89,35.17 J7.S1 85.63,34.38 85.61,34.35 85.61,33.77 84.48,32.64 83.84,32.64 R23.1 | U1.38 7.81,34.15 v5.55,36.4 3.33,38.63 2.23,38.63 2.2,38.66 2.2,39.35 S1.A1 | 44.16,29.95 43.55,29.95 42.27,31.23 42.27,31.28 41.78,31.77 41.78,32.41 41.29,32.9 40.65,32.9 C3.1 40.4,32.9 v39.73,32.9 | 44.16,29.95 44.19,29.93 44.19,29.23 R9.1 | 44.16,29.95 45.08,30.87 VR1.2 | U4.4 45.72,21.79 45.72,21.09 45.98,20.84 45.98,18.61 45.16,17.79 44.47,17.79 C7.- 44.21,17.79 v43.34,17.79 | 67.61,17.38 67.97,17.02 67.97,15.51 67.94,15.49 67.94,14.8 U7.8
  Top 0.508: 67.61,17.38 67.33,17.66 66.69,17.66 C14.1 | C1.1 5.86,13.34 v6.99,13.34 8.12,13.34 C2.1 7.81,13.57 7.81,15.49 U1.1 | 35.51,23.96 35.51,23.42 35.63,23.3 U3.5 | 35.51,23.96 35.63,24.09 U3.4 36.56,24.09 v37.35,24.09 | U3.2 35.41,25.7 35.25,25.55 35.25,24.17 35.3,24.11 35.51,23.96 | R11.1 58.16,33.64 58.16,31.51 R13.1 58.16,31.26 v58.16,30.44 | R17.1 58.16,17.13 R15.1 58.16,17.41 v58.16,18.23 | v84.48,4.4 84.48,5.5 84.28,5.71 83.96,5.71 LED6.C | v54.37,23.76 LED5.C | v37.84,15.46 37.55,15.74 C5.1 | v41.55,29.08 40.65,29.08 C4.1 | v69.58,17.66 70.48,17.66 C15.1 | v67.53,46.36 68.43,46.36 C8.1 | U2.1 8.58,2.89 9.45,2.02 11.72,2.02 J2.1 | v14.18,11.8 R3.1 | v21.79,11.8 22.84,11.8 R4.1 | v14.18,37.73 R1.1 | v21.79,37.73 22.84,37.73 R2.1 | v70.68,37.68 70.68,36.63 U5.1 | v41.8,17.41 40.65,17.41 C6.2 | v27.01,18.79 U1.15 | v71.76,16 71.76,14.8 U7.5 | v2.2,11.01 2.2,9.65 S2.A1 | v72.04,23.73 72.04,22.27 VR3.1 | v63.31,10.11 61.62,10.11 J4.4 | v63.31,44.9 61.62,44.9 J3.4 | v67.58,17.36 67.61,17.38 | v18.97,24.5 15.51,24.5 U1.GND | v75.14,17.18 75.1,17.22 | C9.1 65.91,32.38 v66.99,32.38 | S3.B1 62.06,28.65 v62.5,29.09 | C12.1 64.58,27.43 v64.45,27.3 | 77.46,16.96 78,17.5 78.5,17.5 79,18 78,19 78,21 81,24 C13.- | C18.1 80.01,4 v80.01,2.86
  pour Bottom (isolate 0.254): 0,0 0,49.53 90.17,49.53 90.17,0
GPIO0  (via drill 0.3)
  Top 0.254: U1.25 24.93,33.5 v25.39,33.95 | v12.75,40.04 10.52,40.04 10.5,40.01 S1.B1 | v67.17,48.03 67.35,48.2 69.68,48.2 71.68,46.21 71.68,43.93 72.58,43.03 72.58,41.29 72.6,41.27 80.18,41.27 81.66,42.75 82.71,42.75 83.74,43.78 84.25,43.78 84.3,43.83 84.3,45.59 84.28,45.62 83.02,45.62 82.56,46.08 82.56,46.72 Q2.3 | v61.7,48.26 61.7,48 60.06,46.36 55.58,46.36 53.33,48.61 46.39,48.61 J1.14
  Bottom 0.254: v12.75,40.04 12.75,37.75 16.65,33.85 25.28,33.85 v25.39,33.95 25.85,34.41 26.11,34.61 29.21,37.71 31.62,37.71 32.41,36.91 32.41,36.66 32.74,36.33 34.43,36.33 44.75,46.64 44.75,46.98 J1.14 | v67.17,48.03 66.94,48.26 v61.7,48.26
GPIO2  (via drill 0.3)
  Top 0.254: v27.11,29.93 26.83,30.21 U1.24
  Bottom 0.254: v27.11,29.93 31.05,29.93 34,32.87 34,33.33 47.31,46.64 47.31,46.98 J1.15
GPIO4  (via drill 0.3)
  Top 0.254: U1.26 23.04,34.2 23.07,34.23 23.07,34.38 24.75,36.07 LED2.A 25.52,36.07 25.86,36.07 25.86,35.38 v25.68,35.2 | v28.21,37.66 28.21,37.4 28.88,36.74 31.97,36.74 v38.14,42.91 | v38.99,43.75 42.21,46.98 J1.13
  Bottom 0.254: v25.68,35.2 26.11,35.2 28.21,37.3 v28.21,37.66 | v38.99,43.75 v38.14,42.91
GPIO5  (via drill 0.3)
  Top 0.254: 18.68,35.83 19.2,35.3 19.2,34.23 19.23,34.2 U1.29 | 18.68,35.83 18.43,36.07 17.79,36.07 LED1.A | 18.68,35.83 22.5,39.65 v23.94,39.65 | v25.09,40.81 25.42,41.14 26.8,41.14 31.39,45.72 33.33,45.72 34.59,46.98 J1.10
  Bottom 0.254: v25.09,40.81 v23.94,39.65
GPIO12  (via drill 0.3)
  Top 0.254: 20.74,13.44 21.04,13.44 22.02,14.41 23.94,14.41 24.32,14.8 24.32,15.49 U1.14 | 20.74,13.44 17.79,13.44 LED3.A | v19.3,11.06 19.56,11.06 25.78,4.84 25.78,2.53 25.75,2.51 25.75,1.51 26.88,0.38 43.19,0.38 44.75,1.95 44.75,2 J2.14 | 20.74,13.44 v20.74,12.49
  Bottom 0.254: v20.74,12.49 v19.3,11.06
GPIO13  (via drill 0.3)
  Top 0.254: v27.01,24.29 27.03,24.27 27.03,20.58 26.5,20.05 U1.16 | v28.7,22.02 30.05,22.02 30.31,21.76 30.31,18.6 v38.44,10.46 | v38.6,8.65 38.43,8.47 38.43,6.99 41.73,3.69 46.23,3.69 46.64,3.28 48.59,3.28 49.84,2.02 J2.16 49.95,2.1 51.12,3.28 53.66,3.28 53.68,3.25 63.16,3.25 63.18,3.28 63.18,6.37 63.59,6.78 63.59,8.19 67.66,12.26 70.76,12.26 71.3,11.72 v71.3,11.47 | v73.73,12.29 75.57,14.13 U8.7
  Bottom 0.254: v27.01,24.29 27.01,23.27 28.13,22.14 28.19,22.14 28.26,22.22 28.49,22.22 v28.7,22.02 | v38.6,8.65 38.6,10.3 v38.44,10.46 | v73.73,12.29 73.55,12.47 72.29,12.47 v71.3,11.47
GPIO14  (via drill 0.3)
  Top 0.254: U1.13 23.04,16.2 23.76,16.92 31.02,16.92 37.61,10.33 37.61,4.81 37.76,4.66 39.58,4.66 42.21,2.02 J2.13 | v74.57,12.29 74.57,12.54 75.7,13.67 76.36,13.67 76.83,14.13 76.83,14.77 U8.6 | v70.53,11.65 70.32,11.85 67.84,11.85 64,8.01 64,6.61 63.59,6.2 63.59,3.1 63.33,2.84 55.78,2.84 53.33,0.38 44.39,0.38 v44.21,0.56
  Bottom 0.254: v74.57,12.29 73.98,12.88 72.11,12.88 71.3,12.06 70.94,12.06 v70.53,11.65 | v44.21,0.56 44.03,0.38 43.85,0.38 J2.13
GPIO15  (via drill 0.3)
  Top 0.254: v25.24,16.33 25.24,14.57 24.96,14.29 24.96,13.44 LED4.A 25.52,13.44 27,13.44 28.86,11.58 30.84,11.58 36.38,6.04 v37.02,6.04 | v24.58,18.59 24.58,28.44 25.09,28.95 25.78,28.95 U1.23 | v38.6,5.94 38.89,5.94 41.55,3.28 46.05,3.28 47.31,2.02 J2.15
  Bottom 0.254: v25.24,16.33 25.24,17.92 v24.58,18.59 | v38.6,5.94 38.32,6.22 37.2,6.22 v37.02,6.04
GPIO16  (via drill 0.3)
  Top 0.254: v22.86,35.07 22.68,35.07 21.76,34.15 U1.27 | v28.01,39.96 28.59,40.55 28.59,41.16 31.92,44.49 32.82,44.49 33.18,44.13 34.61,44.13 34.79,43.95 36.94,43.95 v37.02,44.03 | v59.37,30.44 59.19,30.26 59.19,30 57.75,28.57 53.91,28.57 46.62,35.87 46.62,36.38 v46.57,36.43 | v44.47,38.53 44.21,38.53 44.19,38.55 43.93,38.55 40.27,42.21 v40.27,44.16
  Bottom 0.254: v22.86,35.07 27.75,39.96 v28.01,39.96 | 38.64,45.66 39.68,46.69 39.68,46.98 J1.12 | 38.64,45.66 v37.02,44.03 | v59.37,30.44 59.55,30.26 59.95,30.26 63.8,26.42 79.26,26.42 J10.2 | v44.47,38.53 v46.57,36.43 | v40.27,44.16 38.94,45.49 38.81,45.49 38.64,45.66
GPIO17  (via drill 0.3)
  Top 0.254: v25.14,38.45 24.81,38.45 24.65,38.3 24.65,38.12 23.22,36.69 21.94,36.69 20.51,35.25 U1.28 | v28.01,40.81 28.01,41.16 31.74,44.9 33,44.9 33.36,44.54 v35.05,44.54 | v75.21,31.46 75.21,33.1 72.63,35.69 72.6,35.69 72.58,35.71 72.58,37.89 69.73,40.73 69.73,41.01 66.69,44.06 51.05,44.06 50.33,43.34 v50.33,43.09 | v48.54,44.88 48.36,45.06 41.14,45.06 v40.83,44.75 | v39.99,45.59 38.55,45.59 37.17,46.98 J1.11
  Bottom 0.254: v25.14,38.45 25.65,38.45 v28.01,40.81 | v35.05,44.54 37.15,46.64 37.15,46.98 J1.11 | v75.21,31.46 78.26,28.42 79.26,28.42 J10.3 | v48.54,44.88 v50.33,43.09 | v39.99,45.59 v40.83,44.75
GPIO18  (via drill 0.3)
  Top 0.254: v26.27,37.33 26.27,33.59 24.55,31.87 18.89,31.87 17.97,32.79 17.97,33.48 U1.30 | v27.42,38.73 27.42,41.16 31.57,45.31 33.46,45.31 v33.61,45.16 33.72,45.13 36.76,45.13 v43.93,37.97 | v65.89,20.27 67.12,20.27 68.17,19.23 68.17,17.59 69.22,16.54 69.22,14.8 U7.7 | v64.46,21.02 64.2,21.02 58.67,26.55 55.35,26.55 v46.03,35.87
  Bottom 0.254: v27.42,38.73 26.27,37.58 v26.27,37.33 | v33.61,45.16 32.08,46.69 32.08,46.98 J1.9 | v65.89,20.27 65.15,21.02 v64.46,21.02 | v43.93,37.97 v46.03,35.87
GPIO19  (via drill 0.3)
  Top 0.254: v18.41,35.23 17.77,35.23 16.69,34.15 U1.31 | v24.52,41.34 24.78,41.34 24.83,41.4 25.09,41.4 25.24,41.55 26.62,41.55 29.54,44.47 29.54,46.98 J1.8 | v71.27,18.36 71.27,16.9 70.48,16.1 70.48,14.8 U7.6 | v57.63,29.88 55.19,32.31 50.77,32.31 47.36,35.71 v47.36,35.97 | v43.37,37.4 43.37,37.15 42.96,36.74 33.18,36.74 v33,36.91
  Bottom 0.254: v18.41,35.23 v24.52,41.34 24.63,41.4 28.52,41.4 v33,36.91 | v71.27,18.36 59.78,29.85 57.65,29.85 v57.63,29.88 | v47.36,35.97 46.67,35.28 45.49,35.28 v43.37,37.4
GPIO20  (via drill 0.3)
  Top 0.254: v22.2,41.91 22.2,39.94 19.1,36.84 16.92,36.84 16.38,36.3 16.38,35.79 16.23,35.63 16.23,35.25 15.41,34.43 U1.32 | v63.18,35.79 63.18,35.89 61.9,37.17 61.34,37.17 60.39,38.12 60.21,38.12 60.19,38.14 60.06,38.14 60.03,38.12 53.76,38.12 53.09,38.78 48.92,38.78 v48.77,38.63 | v42.96,38.09 42.01,37.15 33.89,37.15 v33.56,37.48
  Bottom 0.254: 25.66,45.38 26.98,46.69 26.98,46.98 J1.7 | 25.66,45.38 v22.2,41.91 | v63.18,35.79 64.33,35.79 65.77,37.22 J11.2 | v48.77,38.63 48.77,37.79 48.31,37.33 47.59,37.33 46.03,38.89 46.03,39.14 45.7,39.48 44.34,39.48 v42.96,38.09 | 25.66,45.38 v33.56,37.48
GPIO21(SDA)  (via drill 0.3)
  Top 0.254: J1.6 24.45,46.98 23.19,45.72 21.22,45.72 20.81,45.31 18.89,45.31 18.05,44.47 18.05,42.73 13.59,38.27 13.59,37.48 14.16,36.91 U1.33 14.16,33.38 14.16,32.79 14.85,32.1 18.07,32.1 18.71,31.46 29.85,31.46 v29.95,31.36 | v36.02,32.72 36.15,32.59 36.74,32.59 37.09,32.95 37.09,33.64 R7.1 | v34.59,32.69 32.72,32.69 30.67,30.64 | 30.67,30.64 29.21,29.18 DISPLAY.4 | 45.72,26.5 45.34,26.11 44.65,26.11 44.24,25.7 40.27,25.7 39.48,26.5 U3.13 | 45.72,26.5 45.72,27.19 U4.5 45.72,27.32 45.72,27.9 45.7,27.93 45.59,27.93 45.18,28.34 44.72,28.34 44.7,28.31 44.08,28.31 43.98,28.21 43.9,28.21 43.83,28.29 43.7,28.29 42.8,29.18 42.8,29.93 41.73,31 41.73,31.05 41.4,31.39 39.94,31.39 39.04,32.28 v39.04,32.49 | v72.14,11.47 70.48,13.13 67.41,13.13 64.33,16.2 63.05,16.2 62.72,16.54 62.72,18.07 62.67,18.12 62.28,18.12 62.13,18.28 58.96,18.28 53.43,23.81 52.53,23.81 49.92,26.42 45.82,26.42 45.72,26.5 | v30.8,30.52 30.67,30.64
  Bottom 0.254: v34.59,32.69 35.99,32.69 v36.02,32.72 36.12,32.64 38.89,32.64 v39.04,32.49 | v72.14,11.47 72.55,11.06 79.26,11.06 J9.2 | v30.8,30.52 v29.95,31.36
GPIO22(SCL)  (via drill 0.3)
  Top 0.254: J1.3 16.82,46.98 16.82,43.26 10.34,36.79 U1.36 10.34,33.38 10.34,32.79 11.44,31.69 17.89,31.69 18.53,31.05 26.83,31.05 27.7,30.18 27.7,27.24 v27.52,27.06 | 37.94,27.09 39.48,27.09 40.45,26.11 41.11,26.11 | 37.94,27.09 37.45,27.09 37.45,26.62 U3.14 | 41.11,26.11 44.06,26.11 44.44,26.5 44.44,27.19 U4.6 | v36.53,28.39 37.09,28.95 37.09,29.82 R8.1 | 37.94,27.09 v37.94,27.75 | v72.14,13.47 70.73,13.47 70.66,13.54 67.58,13.54 65.36,15.77 65.36,19.02 64.64,19.74 64.64,19.99 58.5,26.14 50.79,26.14 50.1,26.83 46.69,26.83 v46.52,27.01 | v41.11,26.29 41.11,26.11 | v33.8,28.78 33.8,28.39 31.17,25.77 DISPLAY.3
  Bottom 0.254: v37.94,27.75 37.18,27.75 v36.53,28.39 36.49,28.39 36.4,28.27 34.3,28.27 v33.8,28.78 | v72.14,13.47 72.32,13.29 74.16,13.29 74.39,13.06 79.26,13.06 J9.3 | v46.52,27.01 45.98,26.47 41.29,26.47 v41.11,26.29 | v27.52,27.06 27.93,27.06 DISPLAY.3
GPIO23  (via drill 0.3)
  Top 0.254: J1.2 14.29,46.98 7.55,40.24 7.55,38.99 9.06,37.48 U1.37 9.06,33.38 9.06,32.79 9.45,32.41 10.14,32.41 11.26,31.28 17.71,31.28 18.36,30.64 23.27,30.64 v24.58,29.34 | v56.58,24.47 57.93,24.47 58.09,24.32 58.09,22.58 60.31,20.35 S3.A1 | v54.32,26.73 54.32,26.98 48.18,33.13 v45.59,33.13
  Bottom 0.254: v54.32,26.73 v56.58,24.47 | v45.59,33.13 45.59,32.87 42.42,29.7 34.87,29.7 34.69,29.88 31.59,29.88 31.23,29.52 27.55,29.52 27.37,29.34 v24.58,29.34
GPIO25  (via drill 0.3)
  Top 0.254: v20.79,14.03 20.61,13.85 20.17,13.85 19.23,14.8 19.23,15.49 U1.10 | v21.63,13.18 21.91,12.9 21.91,12.88 22.17,12.62 23.45,12.62 24.42,11.65 24.42,8.55 27.12,5.85 | 27.12,5.85 28.21,4.76 28.21,4.51 29.03,3.69 30.98,3.69 31.39,3.28 33.33,3.28 34.59,2.02 J2.10 | v61.11,33.72 61.11,33.15 60.54,32.59 59.44,32.59 59.29,32.44 59.24,32.44 58.91,32.1 58.91,30.85 58.78,30.72 58.78,30.18 57.57,28.98 54.09,28.98 53.94,29.13 v53.94,29.39 | v32.15,8.24 31.41,7.5 29.03,7.5 27.98,6.45 27.73,6.45 27.12,5.85
  Bottom 0.254: v21.63,13.18 v20.79,14.03 | v61.11,33.72 61.11,34.82 61.59,35.3 61.85,35.3 63.77,37.22 J11.3 | v53.94,29.39 42.39,17.84 42.39,15.79 39.83,13.23 37.99,13.23 35.58,10.83 34.99,10.83 32.41,8.24 v32.15,8.24
GPIO26  (via drill 0.3)
  Top 0.254: v39.4,17.18 39.4,16.92 39.86,16.46 42.98,16.46 v43.21,16.23 | v21.27,16.72 21.07,16.72 20.51,16.15 20.51,15.51 U1.11 | v24.17,13.82 24.17,13.08 24.55,12.7 26.14,12.7 26.14,11.18 | J2.11 37.17,2.02 37.17,4.15 36.99,4.33 36.99,4.84 30.65,11.18 26.14,11.18 | v30.98,9.42 30.09,9.42 29.77,9.74 26.98,9.74 26.14,10.58 26.14,11.18
  Bottom 0.254: v39.4,17.18 39.58,17 40.19,17 SJ5.2 40.19,16.38 40.19,15.39 38.86,14.05 37.63,14.05 35.23,11.65 34.64,11.65 32.23,9.24 31.16,9.24 v30.98,9.42 | v43.21,16.23 44.01,16.23 44.01,16.49 SJ4.2 | v24.17,13.82 v21.27,16.72
GPIO27  (via drill 0.3)
  Top 0.254: VR1.3 46.03,31.03 45.98,30.98 45.98,29.23 R9.2 45.98,29.08 45.98,28.57 45.95,28.54 45.57,28.54 45.18,28.93 v45.06,28.93 | v22.12,16.72 21.76,16.36 21.76,15.51 U1.12 | v28.12,10.46 28.3,10.64 30.61,10.64 36.58,4.66 v36.58,3.89
  Bottom 0.254: v22.12,16.72 22.12,16.46 24.17,14.41 24.42,14.41 25.28,13.55 | v28.12,10.46 25.15,13.43 25.28,13.55 | v36.58,3.89 36.84,3.89 37.02,3.71 38.27,3.71 39.68,2.3 39.68,2.02 J2.12 | v45.06,28.93 43.01,26.88 38.6,26.88 25.28,13.55
GPIO32  (via drill 0.3)
  Top 0.254: v75.85,18.43 75.67,18.61 75.67,19.3 76.19,19.3 R25.2 | v74.21,18.46 74.44,18.69 74.44,19.23 74.37,19.3 73.78,19.3 R24.1 72.96,19.3 72.83,19.17 70.5,19.17 C15.2 70.37,19.17 69.84,19.17 68.81,18.15 v68.81,17.79 | v18.66,14.03 18.51,14.18 17.36,14.18 16.69,14.85 16.69,15.49 U1.8 | v19.2,12.85 19.2,12.6 27.39,4.4 27.39,4.15 27.9,3.63 | 27.9,3.63 29.52,2.02 J2.8 | v57.52,6.45 50.41,6.45 44.58,12.29 40.5,12.29 v40.22,12.01 | v27.78,3.51 27.9,3.63
  Bottom 0.254: v75.85,18.43 75.83,18.46 v74.21,18.46 | v18.66,14.03 18.66,13.39 v19.2,12.85 | v68.81,17.79 68.81,17.74 v57.52,6.45 | v40.22,12.01 39.4,12.83 38.17,12.83 35.76,10.42 35.17,10.42 31.16,6.4 31.16,6.14 29.13,4.12 28.62,4.12 28.01,3.51 v27.78,3.51
GPIO33  (via drill 0.3)
  Top 0.254: R15.2 59.95,17.15 59.95,17.84 59.98,17.87 61.95,17.87 61.98,17.84 61.98,17.15 R16.1 61.98,17.02 61.98,16.49 62.21,16.26 62.41,16.26 62.72,15.95 62.72,14.18 60.08,11.55 v54.5,11.55 | v17.97,16.72 17.97,15.51 U1.9 | v19.97,12.85 19.97,12.42 27.8,4.58 27.8,4.33 28.85,3.28 30.8,3.28 32.05,2.02 J2.9 | v41.74,10.6 41.74,10.69 v39.01,7.96
  Bottom 0.254: v17.97,16.72 17.97,15.56 19.97,13.57 v19.97,12.85 | v54.5,11.55 54.5,11.42 53.68,10.6 v41.74,10.6 | v39.01,7.96 37.68,6.63 36.4,6.63 32.08,2.3 32.08,2.02 J2.9
GPIO34  (via drill 0.3)
  Top 0.254: R18.1 61.98,15.74 61.95,15.77 59.98,15.77 59.95,15.74 R17.2 59.95,14.98 59.95,14.44 59.9,14.39 58.85,14.39 58.67,14.21 57.65,14.21 54.62,17.24 v47.64,17.24 | U1.6 14.16,15.49 14.16,12.62 13.29,11.75 13.29,10.45 20.05,3.69 20.81,3.69 21.22,3.28 23.19,3.28 24.45,2.02 J2.6 | v46.49,14.57 46.44,14.52 46.44,13.11 41.88,13.11 v40.37,14.62
  Bottom 0.254: v46.49,14.57 46.99,15.07 46.99,16.6 v47.64,17.24 | v40.37,14.62 39.4,13.64 37.81,13.64 35.41,11.24 34.82,11.24 32.41,8.83 30.95,8.83 24.47,2.35 24.47,2.02 J2.6
GPIO35  (via drill 0.3)
  Top 0.254: R14.1 61.98,31.51 61.98,32.15 61.95,32.18 59.98,32.18 59.95,32.15 59.95,31.51 R13.2 59.95,31.39 59.95,30.05 59.73,29.82 59.73,26.09 60.49,25.32 v60.75,25.32 | U1.7 15.41,15.49 15.41,14.85 15.92,14.34 16.15,14.34 16.23,14.26 16.23,13.9 16.38,13.75 16.38,13.23 16.92,12.7 18.51,12.7 26.19,5.02 26.19,2.82 26.98,2.02 J2.7 | v47.66,14.51 47.66,12.7 40.06,12.7 39.45,12.08 v39.45,11.83
  Bottom 0.254: v60.75,25.32 52.61,17.18 48.93,17.18 47.66,15.91 v47.66,14.51 | v39.45,11.83 38.86,12.42 38.35,12.42 35.94,10.01 35.35,10.01 31.57,6.22 31.57,5.96 29.31,3.71 28.8,3.71 28.36,3.28 28.36,3.23 28.21,3.07 28.19,3.07 27.14,2.02 27.01,2.02 J2.7
N$1  (via drill 0.3)
  Top 0.254: v86.96,30.93 87.01,30.87 87.99,30.87 Q3.1 | v85.94,29.9 85.94,30.16 85.27,30.82 84.56,30.82 84.53,30.85 83.84,30.85 R23.2 83.71,30.85 83.33,30.85 83.33,28.24 83.05,27.95 82.07,27.95 82.05,27.98 81.97,27.98 80.1,29.85 80.1,30.18 79.51,30.77 78.69,30.77 77.93,31.54 v77.93,31.8 | v76.98,31.05 76.8,30.87 74.7,30.87 73.27,32.31 73.27,33 D1.A | v81.82,35.25 83.74,37.17 85.45,37.17 J7.1
  Bottom 0.254: v85.94,29.9 v86.96,30.93 | v76.98,31.05 77.72,31.8 v77.93,31.8 78.03,31.87 78.44,31.87 v81.82,35.25
N$3
  Top 0.635: 74.29,8 74.29,3.17 74.91,2.56 J6.1 | 74.29,8 U8.1 | 74.29,8 75,8 C17.2
N$4
  Top 0.254: U2.2 6.68,3.56 6.68,4.2 7.25,4.76 10.16,4.76 10.42,5.02 R6.1
N$7  (via drill 0.3)
  Top 0.254: v64.74,38.66 63.77,37.68 R12.2 | v65.33,40.12 65.05,40.4 62.82,40.4 62.31,40.91 61.62,40.91 J3.2
  Bottom 0.254: v64.74,38.66 64.74,39.3 64.92,39.48 64.92,39.68 65.33,40.09 v65.33,40.12
N$8  (via drill 0.3)
  Top 0.254: v41.06,18.38 41.06,18.64 40.35,19.35 40.35,21.45 39.3,22.5 U3.8
  Bottom 0.254: v41.06,18.38 41.06,17.66 41.09,17.64 SJ5.1
N$9  (via drill 0.3)
  Top 0.254: v45.7,16.79 43.49,16.79 40.76,19.53 40.76,21.63 39.58,22.81 39.58,22.99 39.27,23.3 U3.9
  Bottom 0.254: v45.7,16.79 45.67,16.82 44.9,16.82 SJ4.1
N$10  (via drill 0.3)
  Top 0.508: C8.2 69.99,46.36 70.76,46.36 71.14,45.98 71.14,43.39 70.68,42.93 70.68,42.24 U5.16 70.68,41.96 70.68,41.14 74.5,37.33 74.5,36.86 U5.4 74.5,36.61 74.5,35.92 75.88,34.53 v84.48,34.53 | v86.53,34 86.53,33.92 86.58,33.87 86.58,33.41 87.35,32.64 87.99,32.64 Q3.2
  Bottom 0.508: v86.53,34 85.99,34.53 v84.48,34.53
N$14
  Top 0.254: U6.1 85.43,24.19 85.43,23.55 83.15,21.27 79.92,21.27 79.67,21.02 S4.A1
N$15  (via drill 0.3)
  Top 0.254: C10.2 78.72,29.98 78.08,29.98 78.05,30 78.05,30.82 76.57,32.31 76.57,33 X1.2 76.57,33.13 76.57,33.72 76.85,34 78.11,34 v78.28,33.82 | v78.28,35.25 78.28,36.61 U5.7
  Bottom 0.254: v78.28,33.82 v78.28,35.25
N$18
  Top 0.508: VR2.3 70.14,26.35 70.17,26.24 83.53,26.24 84.66,27.37 84.66,27.7 84.69,27.73 86.14,27.73 86.32,27.55 86.32,27.32 86.35,27.29 U6.5
N$19
  Top 0.254: Q1.1 75.31,44.72 75.31,45.41 74.09,46.64 73.75,46.64 73.73,46.62 R20.1
N$20  (via drill 0.3)
  Top 0.254: C11.2 82.53,28.7 81.84,28.7 80.51,30.03 80.51,31.92 80.9,32.31 80.9,33 X1.1 80.9,33.13 80.9,33.72 80.61,34 79.72,34 v79.54,33.82 | v79.56,35.25 79.56,36.61 U5.8
  Bottom 0.254: v79.56,35.25 79.56,33.84 v79.54,33.82
N$21  (via drill 0.3)
  Top 0.254: v41.34,20.1 41.16,20.27 41.16,21.81 39.99,22.99 39.99,23.17 39.55,23.6 39.55,25.42 39.27,25.7 U3.12
  Bottom 0.254: v41.34,20.1 38.07,16.82 37.27,16.82 SJ6.1
N$22
  Top 0.635: 78.11,7.5 78.11,3.17 77.49,2.56 J6.2 | 78.11,7.5 U8.4 | 78.11,7.5 77,7.5 C17.1
N$23
  Top 0.635: 67.94,7.5 67.94,3.17 68.56,2.56 J5.1 | 67.94,7.5 U7.1 | 67.94,7.5 69,7.5 C16.2
N$24
  Top 0.635: 71.76,8 71.76,3.17 71.14,2.56 J5.2 | 71.76,8 U7.4 | 71.76,8 71,8 C16.1
N$25  (via drill 0.3)
  Top 0.254: v68.12,34.69 67.1,33.67 65.28,33.67 63.77,32.15 63.77,31.51 R14.2 | v69.73,36.3 69.73,36.56 69.22,37.07 68.12,37.07 65.92,39.27 65.92,40.37 65.48,40.81 64.41,40.81 62.31,42.91 61.62,42.91 J3.3
  Bottom 0.254: v69.73,36.3 v68.12,34.69
N$30
  Top 0.254: Q2.1 81.66,44.72 81.66,45.36 80.44,46.59 80.1,46.59 80.08,46.62 R21.1
N$31  (via drill 0.3)
  Top 0.508: F1.A 69.45,23.55 70.81,24.91 72.37,24.91 74.32,22.96 74.32,22.27 VR3.2 74.5,23 v74.5,24
  Bottom 0.508: v74.5,24 73.5,23 73.5,22.5 74,22 75,22 SJ2.1
N$32
  Top 0.254: LED2.C 24.7,37.58 23.5,36.38 23.5,35.97 23.48,35.94 22.86,35.94 R2.2
N$33
  Top 0.254: LED1.C 17.77,37.58 17.07,37.58 15.97,36.48 15.97,35.97 15.95,35.94 15.26,35.94 R1.2
N$34
  Top 0.254: R21.2 79.36,44.83 78.67,44.83 78.34,45.16 77.08,45.16 77.08,44.72 Q1.2 77.08,45.26 77.08,45.41 76.88,45.62 75.7,45.62 73.96,47.36 72.11,47.36 72.09,47.33 72.09,44.11 73.22,42.98 73.22,42.24 U5.14
N$35
  Top 0.254: LED4.C 24.7,11.96 23.76,12.9 23.76,13.39 23.55,13.59 R4.2
N$36
  Top 0.254: LED3.C 17.77,11.96 17.07,11.96 15.97,13.06 15.97,13.57 15.95,13.59 15.26,13.59 R3.2
N$38
  Top 0.254: 74.73,43.16 82.53,43.16 83.43,44.06 Q2.2 | 74.73,43.16 74.5,42.93 74.5,42.24 U5.13 | R20.2 73.68,44.83 74.47,44.03 74.47,43.44 74.65,43.26 74.73,43.16
N$41  (via drill 0.3)
  Top 0.254: v64.77,16.61 63.77,16.61 63.77,17.13 R16.2 | v64.64,15.05 64.64,9.83 63.18,8.37 63.18,6.96 62.31,6.09 61.62,6.09 J4.2
  Bottom 0.254: v64.77,16.61 64.77,15.18 v64.64,15.05
N$42
  Top 0.254: R18.2 63.77,15.08 63.77,10.5 63.9,10.37 63.9,9.68 62.31,8.09 61.62,8.09 J4.3
N$43  (via drill 0.3)
  Top 0.508: VR1.5 44.13,34.41 40.65,34.41 C3.2 40.4,34.41 39.94,34.41 37.97,32.44 37.97,28.8 36.79,27.62 36.76,27.62 36.45,27.32 36.45,26.73 U3.1 35,26.5 34.33,25.83 34.33,23.88 34.29,23.83 | 37.45,17.28 38.27,17.28 39.94,15.62 40.63,15.62 C6.1 40.91,15.62 41.34,15.62 41.73,15.23 C7.+ 44.7,15.23 45.16,15.23 46.41,16.49 | 37.45,17.28 C5.2 | v50.97,24.52 46.64,20.2 46.64,18.33 46.41,18.1 46.41,16.49 | 46.41,16.49 46.64,16.36 48.64,16.36 48.9,16.1 48.9,12.57 51.69,9.78 55.75,9.78 58.67,6.86 58.67,5.97 59.82,4.83 60.87,4.83 J4.1 | v59.88,38.73 60.06,38.91 61.59,38.91 J3.1 | 37.45,17.28 37.45,22.14 U3.7 37.45,22.43 37.45,22.5 36.35,22.5 U3.6 36.1,22.5 34.65,22.5 34.29,22.86 34.29,23.83 | DISPLAY.2 30.08,23.23 30.68,23.83 34.29,23.83
  Bottom 0.508: v50.97,24.52 51.35,24.91 52.05,24.91 SJ3.2 52.2,25.14 52.25,25.19 52.25,25.75 54.66,28.16 54.66,30.95 59.88,36.17 v59.88,38.73
N$44
  Top 0.254: U5.3 73.22,36.63 73.22,37.84 70.14,40.91 70.14,41.19 66.33,45.01 66.33,46.9 66.3,46.92 R19.2
N$45  (via drill 0.3)
  Top 0.254: v67.94,35.46 66.38,35.46 66.3,35.53 66.3,36.17 R22.2 | v68.97,36.48 68.97,36.22 69.5,35.69 71.71,35.69 71.94,35.92 71.94,36.61 U5.2
  Bottom 0.254: v68.97,36.48 v67.94,35.46
N$51
  Top 0.254: R26.1 81.65,4.93 LED6.A
N$52  (via drill 0.3)
  Top 0.254: v83.09,3.63 83.09,2.9 R26.2
  Bottom 0.254: SJ1.1 83.27,3.49 83.13,3.63 v83.09,3.63
N$55
  Top 0.254: LED5.A 55.27,25.24 56.29,25.24 56.45,25.39 R10.1
N$58  (via drill 0.3)
  Top 0.254: v53.17,24.4 53.27,24.5 55.96,24.5 55.99,24.47 55.99,24.11 56.5,23.6 R10.2
  Bottom 0.254: v53.17,24.4 52.86,24.09 SJ3.1
RXD  (via drill 0.3)
  Top 0.254: v64.36,35.12 64.51,35.28 64.51,36.17 R22.1 | v61.85,34.71 55.63,34.71 52.63,37.71 49.64,37.71 49.31,37.38 48.36,37.38 47.72,36.74 v47.59,36.74 | v45.44,38.89 45.44,38.63 43.14,36.33 28.7,36.33 23.19,41.83 23.19,44.95 v23.37,45.13 | U1.34 12.88,38.14 17.64,42.91 17.64,44.65 18.71,45.72 20.63,45.72 21.89,46.98 J1.5
  Bottom 0.254: v64.36,35.12 63.95,34.71 v61.85,34.71 | v45.44,38.89 v47.59,36.74 | v23.37,45.13 23.37,45.18 21.91,46.64 21.91,46.98 J1.5
SENS_VN
  Top 0.254: U1.5 12.88,15.49 12.88,10.27 19.87,3.28 20.63,3.28 21.89,2.02 J2.5
SENS_VP  (via drill 0.3)
  Top 0.254: R12.1 61.98,34.12 61.59,34.12 61.41,34.3 59.98,34.3 59.95,34.28 R11.2 59.95,33.54 59.95,33.02 59.93,33 59.06,33 v59.03,33.02 | J2.4 19.38,2.02 19.38,3.17 11.62,10.93 11.62,15.49 U1.4 11.62,15.62 11.62,16.2 12.34,16.92 16.97,16.92 v17.15,16.74 | v57.45,32.72 50.94,32.72 48.61,35.05 v48.61,35.3
  Bottom 0.254: v59.03,33.02 58.73,32.72 v57.45,32.72 | v48.61,35.3 40.6,27.29 38.43,27.29 26.88,15.74 23.94,15.74 22.37,17.31 17.71,17.31 v17.15,16.74
TXD  (via drill 0.3)
  Top 0.254: v61.01,45.88 61.01,46.13 63.08,48.2 64.51,48.2 64.51,47.64 R19.1 | v49.13,45.47 44.57,45.47 43.47,46.57 43.47,47.49 42.34,48.61 20.99,48.61 J1.4 19.3,46.9 17.23,44.83 17.23,43.09 11.62,37.48 11.62,33.51 U1.35
  Bottom 0.254: v61.01,45.88 60.49,45.36 52.86,45.36 52.79,45.29 49.31,45.29 v49.13,45.47
USB_N
  Top 0.254: U5.6 77.03,36.92 77.82,37.71 85.35,37.71 J7.2
USB_P
  Top 0.254: U5.5 75.75,36.92 76.95,38.12 84.24,38.12 84.6,38.48 J7.3
V_BATT  (via drill 0.3)
  Top 0.635: VR3.3 76.59,22.25 76.59,21.55 75.75,20.71 75.55,20.71 75.06,20.22 75.06,18.2 74.37,17.51 73.68,17.51 R24.2 73.34,17.51 73.01,17.51 72.93,17.43 72.93,10.65 | 70.45,10.04 69.25,10.04 69.22,10.01 69.22,9.37 U7.2 | 70.45,10.04 70.48,10.01 70.48,9.37 U7.3 | 75.6,10.04 75.57,10.01 75.57,9.37 U8.2 | 76.8,10.04 75.6,10.04 | 76.8,10.04 76.83,10.01 76.83,9.37 U8.3 | 72.93,10.65 75.16,10.65 75.47,10.34 75.6,10.04 | 72.93,10.65 70.89,10.65 70.58,10.34 70.45,10.04 | 79.21,10.42 81.38,10.42 J8.+ | 79.21,10.42 78.98,10.65 77.23,10.65 76.93,10.34 76.8,10.04 | C13.+ 78.5,24 76.5,24 76.5,22.5 VR3.3 | v76,20.5 76.5,21 76.5,21.5 VR3.3 | C18.2 79.69,9.93 79.21,10.42
  Bottom 0.635: v76,20.5 76,21.5 SJ2.2
V_USB  (via drill 0.3)
  Top 0.508: C14.2 65.97,19.17 65.18,19.97 65.18,22.12 65.15,22.14 65.15,22.84 F1.C 65,23.5 65,25 65.5,25.5 C12.2 66.06,25.57 67.31,25.57 | U6.6 85.43,26.57 85.43,25.93 85.4,25.91 84.15,25.91 83.81,25.57 67.31,25.57 | 48.23,39.86 48.23,42.6 52.38,46.75 52.38,46.98 J1.17 | 48.23,39.86 48.23,39.12 44.88,35.76 44.88,33.28 44.85,33.25 44.83,33.25 44.13,32.56 44.13,31.74 VR1.1 | 48.23,39.86 64.56,39.86 68.97,35.46 D1.C 68.97,32.77 68.97,32.63 68.91,32.63 66.87,30.6 v66.87,29.73 | 67.31,25.57 67.95,26.21 VR2.1 67.95,27.65 v68.28,27.98
  Bottom 0.508: v68.28,27.98 68.28,28.33 v66.87,29.73

### Text on the board
tNames: GND | GPIO23 | GPIO22 | GPIO1_TX | GPIO3_RX | GPIO21 | GPIO20 | GPIO19 | GPIO18 | GPIO5 | GPIO17 | GPIO16 | GPIO4 | GPIO0 | GPIO2 | 3.3V | 5V | GND | GPIO35 | ANALOG-2 | GPIO36 | BOOT | 3.3V | CH340G | USB | AUX PWR | ATTEC608A | REG1117 | OLED Display | USER BUTTON | ADXL345 | ESP32-WROOM | POWER (ON/OFF) | - | L9110 | L9110 | RESET | GND | + | GPIO34 | ANALOG-1 | PWR | GPIO33 | LEFT | RIGHT | (4.5-12V) | GND | 3.3V | EN | GPIO36 | GPIO39 | GPIO34 | GPIO35 | GPIO32 | GPIO33 | GPIO25 | GPIO26 | GPIO27 | GPIO14 | GPIO12 | GPIO15 | GPIO13 | GND | 3.3V | MOTORS
bNames: ENCODERS | GND | GPIO23 | GPIO22 (SCL) | GPIO1 (TX0) | GPIO3 (RX0) | GPIO21 (SDA) | GPIO20 | GPIO19 | GPIO18 | GPIO5 | GPIO17 | GPIO16 | GPIO4 | GPIO0 | GPIO2 | 3.3V | 5V | USB | 3.3V | GPIO25 | GPIO20 | GND | SERIAL2 | Playground4Robotics | 3.3V | SDA | GPIO17 (TX2) | SCL | GPIO16 (RX2) | GND | 3.3V | AUX PWR | VR3_BYPASS | GND | I2C | 3.3V | SDO | INT1 | INT2 | GPIO22(SCL) | GPIO21(SDA) | GND | LEFT | RIGHT | MOTOR | MOTOR | GND | 3.3V | EN | GPIO36 | GPIO39 | GPIO34 | GPIO35 | GPIO32 | GPIO33 | GPIO25 | GPIO26 | GPIO27 | GPIO14 | GPIO12 | GPIO15 | GPIO13 | GND | PWR LED